# Altium project Embedded_board.PrjPCB
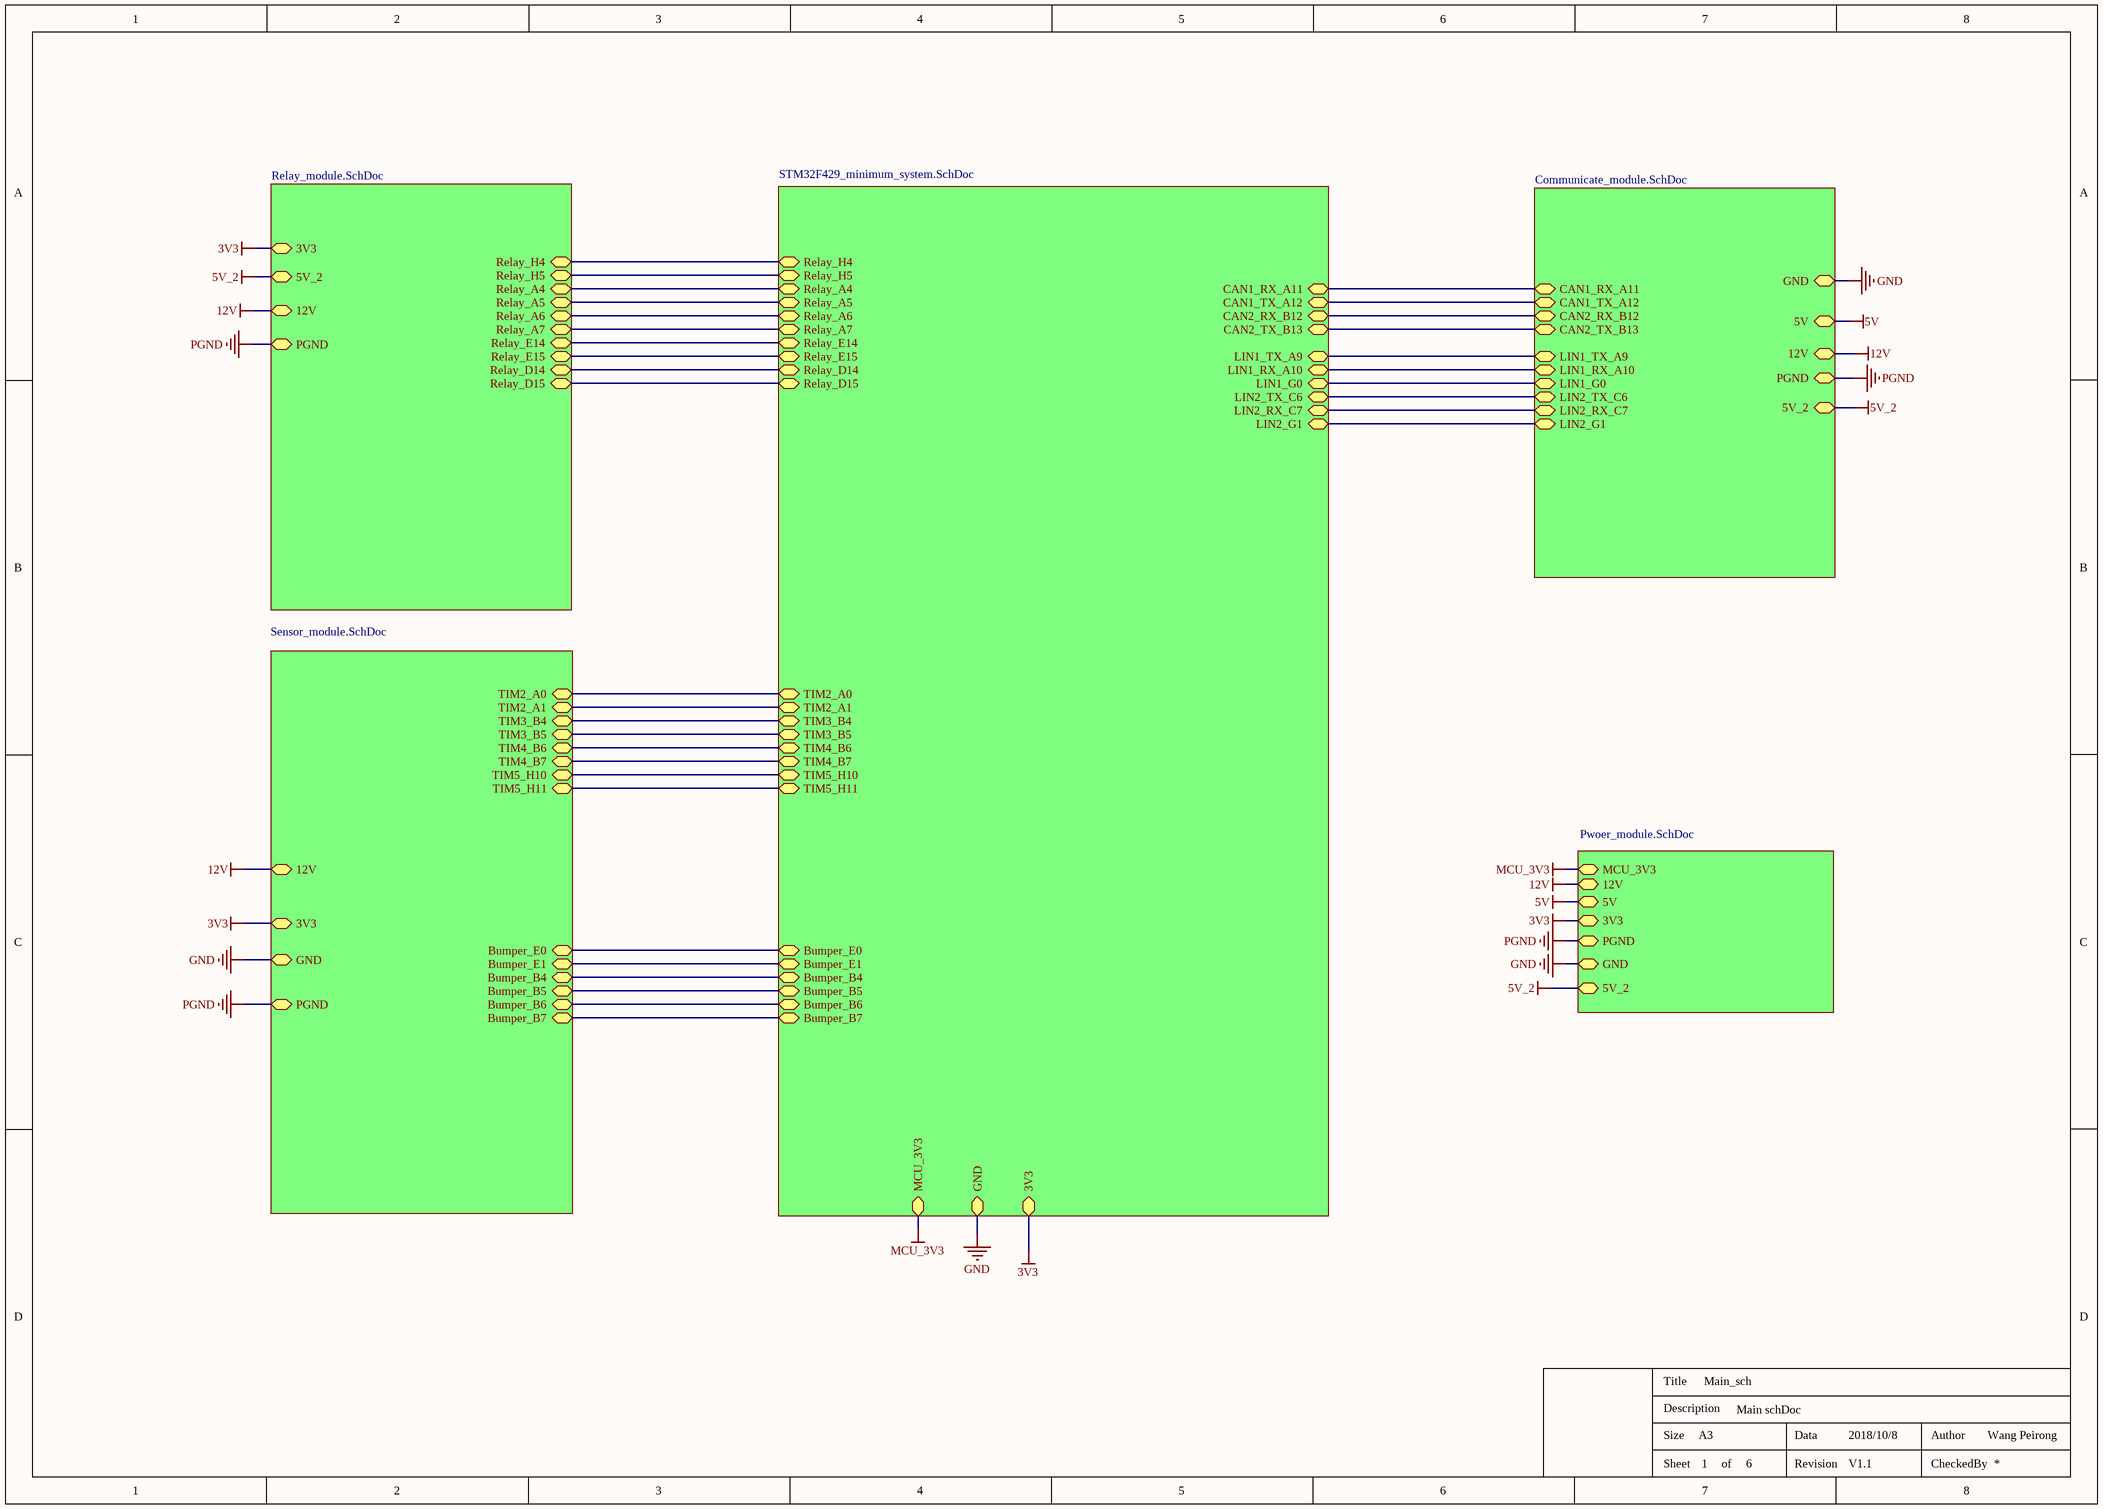
[diagram p0: Main_sch.SchDoc]
6 sheets, 264 parts. Net scope: hierarchical (ports join the sheet entries above them; power ports are global).
Board file: Embedded_board.PcbDoc
Sheets:
  Main_sch.SchDoc
     = Pwoer_module.SchDoc
     = Sensor_module.SchDoc
     = STM32F429_minimum_system.SchDoc
     = Relay_module.SchDoc
     = Communicate_module.SchDoc

## Sheet Main_sch.SchDoc: Main_sch
size A3; Date: 2018/10/8; Author: Wang Peirong; Revision: V1.1; SheetNumber: 1; SheetTotal: Main schDoc; Size: A3; Pages: 6

### Sub-sheets
? = Pwoer_module.SchDoc: 3V3, 12V, 5V, GND, PGND, 5V_2, MCU_3V3
? = Sensor_module.SchDoc: 12V, 3V3, GND, PGND, TIM2_A0, TIM2_A1, TIM3_B4, TIM3_B5, TIM4_B6, TIM4_B7, TIM5_H10, TIM5_H11, Bumper_E0, Bumper_E1, Bumper_B4, Bumper_B5, Bumper_B6, Bumper_B7
? = STM32F429_minimum_system.SchDoc: MCU_3V3, GND, CAN2_RX_B12, CAN2_TX_B13, CAN1_RX_A11, CAN1_TX_A12, TIM2_A0, TIM2_A1, TIM3_B4, TIM3_B5, TIM4_B6, TIM4_B7, TIM5_H10, TIM5_H11, Bumper_E0, Bumper_E1, Bumper_B4, Bumper_B5, Bumper_B6, Bumper_B7, Relay_H4, Relay_H5, Relay_A4, Relay_A5, Relay_A6, Relay_A7, Relay_E14, Relay_E15, LIN1_TX_A9, LIN1_RX_A10, LIN1_G0, LIN2_G1, LIN2_RX_C7, LIN2_TX_C6, Relay_D14, Relay_D15, 3V3
? = Relay_module.SchDoc: 3V3, 5V_2, 12V, PGND, Relay_H4, Relay_H5, Relay_A4, Relay_A5, Relay_A6, Relay_A7, Relay_E14, Relay_E15, Relay_D14, Relay_D15
? = Communicate_module.SchDoc: GND, 5V, CAN1_RX_A11, CAN1_TX_A12, CAN2_RX_B12, CAN2_TX_B13, 12V, PGND, LIN1_TX_A9, LIN1_RX_A10, 5V_2, LIN2_G1, LIN1_G0, LIN2_RX_C7, LIN2_TX_C6

### Nets
3V3: sheet /3V3, sheet /3V3, sheet /3V3, sheet /3V3
5V: sheet /5V, sheet /5V
5V_2: sheet /5V_2, sheet /5V_2, sheet /5V_2
12V: sheet /12V, sheet /12V, sheet /12V, sheet /12V
GND: sheet /GND, sheet /GND, sheet /GND, sheet /GND
MCU_3V3: sheet /MCU_3V3, sheet /MCU_3V3
PGND: sheet /PGND, sheet /PGND, sheet /PGND, sheet /PGND
H4: sheet /Relay_H4, sheet /Relay_H4
H5: sheet /Relay_H5, sheet /Relay_H5
NetJ1_4: sheet /TIM2_A0, sheet /TIM2_A0
NetJ2_4: sheet /TIM2_A1, sheet /TIM2_A1
NetJ3_4: sheet /TIM3_B4, sheet /TIM3_B4
NetJ4_4: sheet /TIM3_B5, sheet /TIM3_B5
NetJ5_4: sheet /TIM4_B6, sheet /TIM4_B6
NetJ6_4: sheet /TIM4_B7, sheet /TIM4_B7
NetJ7_4: sheet /TIM5_H10, sheet /TIM5_H10
NetJ8_4: sheet /TIM5_H11, sheet /TIM5_H11
NetJ9_4: sheet /Bumper_B5, sheet /Bumper_B5
NetJ10_4: sheet /Bumper_B6, sheet /Bumper_B6
NetJ11_4: sheet /Bumper_B7, sheet /Bumper_B7
NetJ12_4: sheet /Bumper_E0, sheet /Bumper_E0
NetJ13_4: sheet /Bumper_E1, sheet /Bumper_E1
NetJ14_4: sheet /Bumper_B4, sheet /Bumper_B4
NetJ23_2: sheet /LIN1_TX_A9, sheet /LIN1_TX_A9
NetJ24_4: sheet /LIN1_RX_A10, sheet /LIN1_RX_A10
NetJ25_2: sheet /LIN1_G0, sheet /LIN1_G0
NetJ26_4: sheet /LIN2_RX_C7, sheet /LIN2_RX_C7
NetJ27_2: sheet /LIN2_G1, sheet /LIN2_G1
NetJ28_2: sheet /LIN2_TX_C6, sheet /LIN2_TX_C6
NetR49_1: sheet /Relay_A4, sheet /Relay_A4
NetR53_1: sheet /Relay_A5, sheet /Relay_A5
NetR57_1: sheet /Relay_A6, sheet /Relay_A6
NetR61_1: sheet /Relay_A7, sheet /Relay_A7
NetR65_2: sheet /Relay_E14, sheet /Relay_E14
NetR69_1: sheet /Relay_E15, sheet /Relay_E15
NetR97_1: sheet /Relay_D14, sheet /Relay_D14
NetR101_2: sheet /Relay_D15, sheet /Relay_D15
NetU1_92: sheet /CAN2_RX_B12, sheet /CAN2_RX_B12
NetU1_93: sheet /CAN2_TX_B13, sheet /CAN2_TX_B13
NetU1_122: sheet /CAN1_RX_A11, sheet /CAN1_RX_A11
NetU1_123: sheet /CAN1_TX_A12, sheet /CAN1_TX_A12

### Notes on the sheet
- Title
- Description
- Size
- Data
- Author
- Sheet
- of
- Revision
- CheckedBy

## Sheet Pwoer_module.SchDoc: Power_module
size A4; Date: 2018/10/8; Author: Wang Peirong; Revision: V1.1; SheetNumber: 3; Descripton: Supply 12V ，5V，3.3V; pages: 6; Size: A4
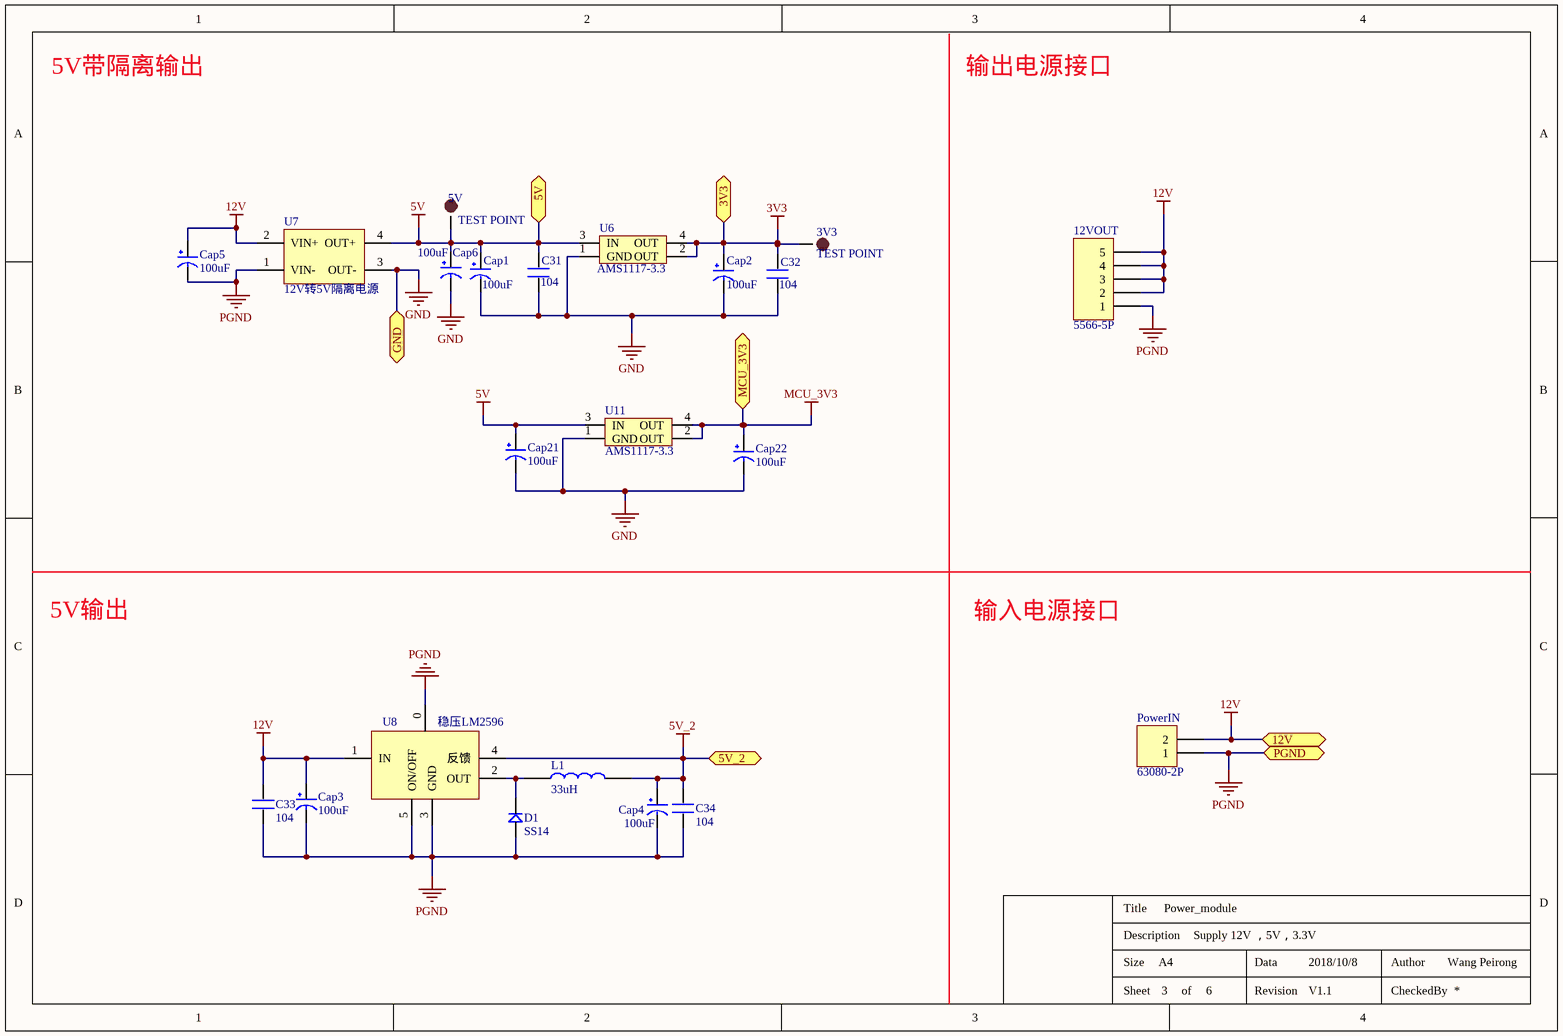
[diagram p1: Pwoer_module.SchDoc]

### Parts
3V3  TEST POINT  [TP-1.5]
5V  TEST POINT  [TP-1.5]
12VOUT  5566-5P  [5566-5P]
C31  104  [0603P]
C32  104  [0603P]
C33  104  [0603P]
C34  104  [0603P]
Cap1  100uF  [CC6.56.5]
Cap2  100uF  [CC6.56.5]
Cap3  100uF  [CC6.56.5]
Cap4  100uF  [CC6.56.5]
Cap5  100uF  [CC6.56.5]
Cap6  100uF  [CC6.56.5]
Cap21  100uF  [CC6.56.5]
Cap22  100uF  [CC6.56.5]
D1  SS14  [DIODE_SOP]
L1  value 33uH  [电感-10*10]  (hidden comment: 6电感)
PowerIN  63080-2P  [63038-2P]
U6  AMS1117-3.3  [AMS1117]
U7  12V转5V隔离电源  [WRB1205MH]
U8  稳压LM2596  [TO-263-5]
U11  AMS1117-3.3  [AMS1117]

### Ports
3V3, 5V, 5V_2, 12V, GND, MCU_3V3, PGND

### Nets
3V3: 3V3.1 C32.2 Cap2.1(VCC) U6.2(OUT) U6.4(OUT) ; port 3V3
5V: 5V.1 C31.2 Cap1.1(VCC) Cap6.1(VCC) Cap21.1(VCC) U6.3(IN) U7.4(OUT+) U11.3(IN) ; port 5V
5V_2: C34.2 Cap4.1(VCC) L1.2 U8.4(反馈) ; port 5V_2
12V: 12VOUT.2 12VOUT.3 12VOUT.4 12VOUT.5 C33.2 Cap3.1(VCC) Cap5.1(VCC) PowerIN.2 U7.2(VIN+) U8.1(IN) ; port 12V
GND: C31.1 C32.1 Cap1.2(GND) Cap2.2(GND) Cap6.2(GND) Cap21.2(GND) Cap22.2(GND) U6.1(GND) U7.3(OUT-) U11.1(GND) ; port GND
MCU_3V3: Cap22.1(VCC) U11.2(OUT) U11.4(OUT) ; port MCU_3V3
PGND: 12VOUT.1 C33.1 C34.1 Cap3.2(GND) Cap4.2(GND) Cap5.2(GND) D1.1 PowerIN.1 U7.1(VIN-) U8.0 U8.3(GND) U8.5(ON/OFF) ; port PGND
NetD1_2: D1.2 L1.1 U8.2(OUT)

### Notes on the sheet
- 5V带隔离输出
- 输出电源接口
- 5V输出
- 输入电源接口
- Title
- Description
- Size
- Data
- Author
- Sheet
- of
- Revision
- CheckedBy

### Library data of the parts
3V3 5V = TEST-POINT: 测试点
12VOUT = Header 5: Header, 5-Pin; LatestRevisionDate: 17-Jul-2002; LatestRevisionNote: Re-released for DXP Platform.; Publisher: Altium Limited
C31-C34 = C
Cap1-Cap6 Cap21 Cap22 = CAP
D1 = D
L1 = 6电感: Adjustable Inductor; Set Position: 0.5; Published: 24-Mar-1999; LatestRevisionDate: 17-Jul-2002; LatestRevisionNote: Re-released for DXP Platform.; PackageReference: AXIAL-0.8; Publisher: Altium Limited; PackageDescription: Axial Device, Thru-Hole; 2 Leads; 0.8 in Pin Spacing
PowerIN = Header 2: Header, 2-Pin; LatestRevisionDate: 17-Jul-2002; LatestRevisionNote: Re-released for DXP Platform.; Publisher: Altium Limited
U6 U11 = AMS1117

## Sheet Sensor_module.SchDoc: Sensor_module
size A4; Date: 2018/10/8; Author: Wang Peirong; Revision: V1.1; SheetNumber: 4; Descripton: Encoder interface and bumper interface; pages: 6; Size: A4
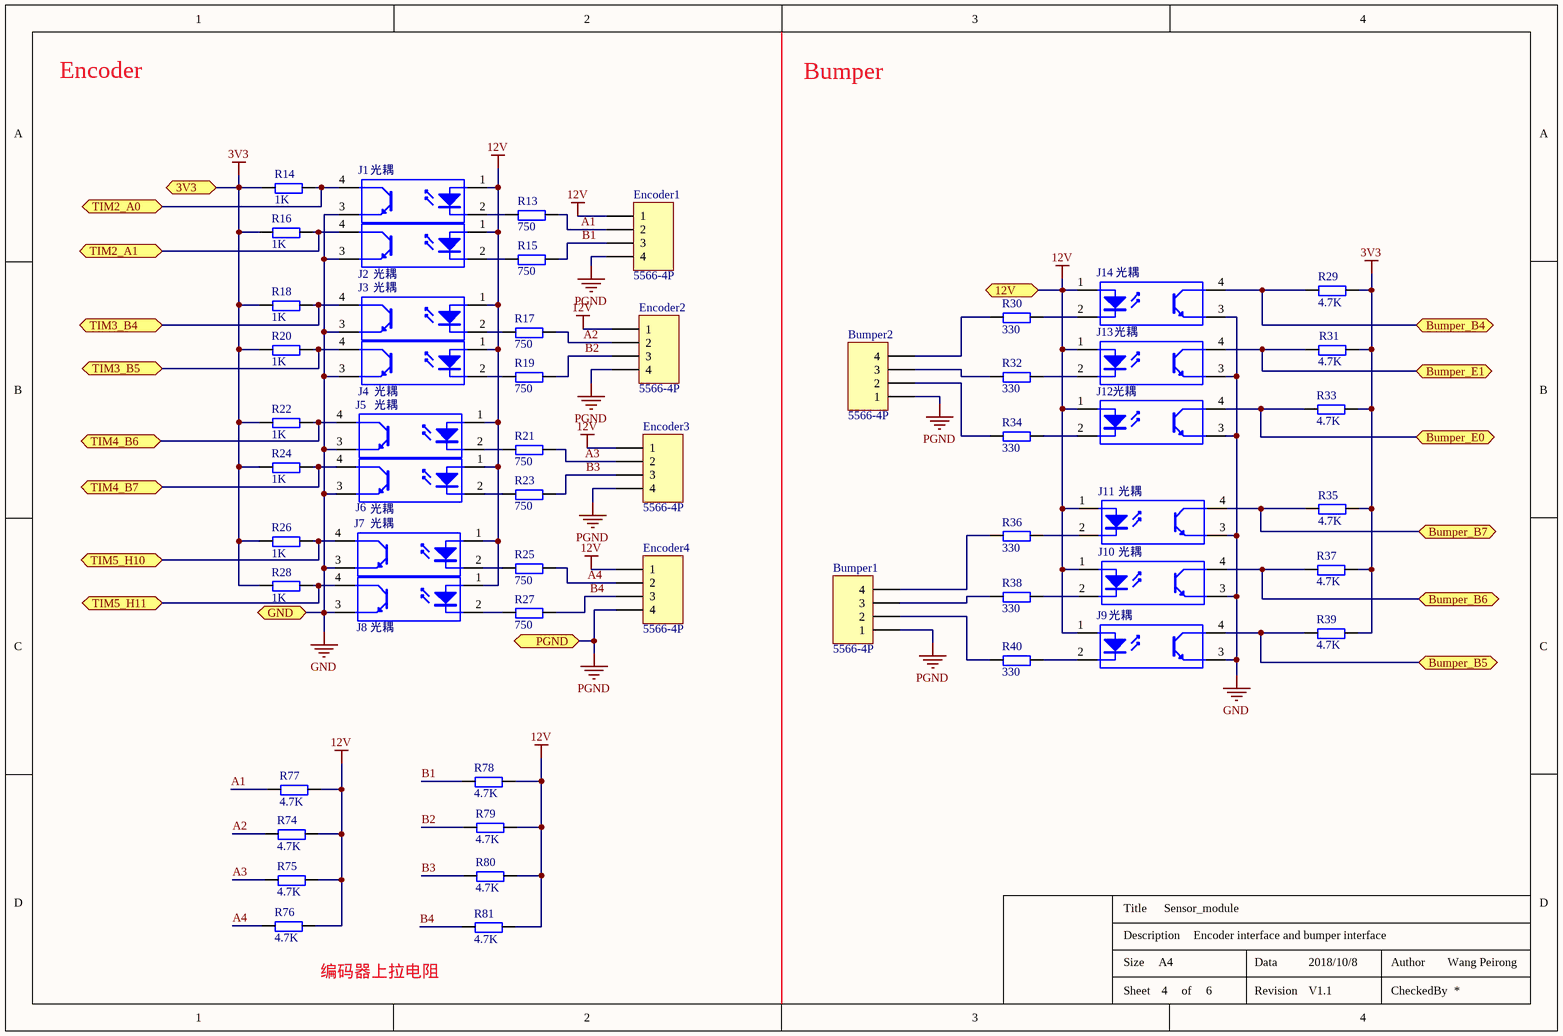
[diagram p2: Sensor_module.SchDoc]

### Parts
Bumper1  5566-4P  [5566-4P]
Bumper2  5566-4P  [5566-4P]
Encoder1  5566-4P  [5566-4P]
Encoder2  5566-4P  [5566-4P]
Encoder3  5566-4P  [5566-4P]
Encoder4  5566-4P  [5566-4P]
J1  光耦  [SOP127P710X350-4N]
J2  光耦  [SOP127P710X350-4N]
J3  光耦  [SOP127P710X350-4N]
J4  光耦  [SOP127P710X350-4N]
J5  光耦  [SOP127P710X350-4N]
J6  光耦  [SOP127P710X350-4N]
J7  光耦  [SOP127P710X350-4N]
J8  光耦  [SOP127P710X350-4N]
J9  光耦  [SOP127P710X350-4N]
J10  光耦  [SOP127P710X350-4N]
J11  光耦  [SOP127P710X350-4N]
J12  光耦  [SOP127P710X350-4N]
J13  光耦  [SOP127P710X350-4N]
J14  光耦  [SOP127P710X350-4N]
R13  750  [0603P]
R14  1K  [0603P]
R15  750  [0603P]
R16  1K  [0603P]
R17  750  [0603P]
R18  1K  [0603P]
R19  750  [0603P]
R20  1K  [0603P]
R21  750  [0603P]
R22  1K  [0603P]
R23  750  [0603P]
R24  1K  [0603P]
R25  750  [0603P]
R26  1K  [0603P]
R27  750  [0603P]
R28  1K  [0603P]
R29  4.7K  [0603P]
R30  330  [0603P]
R31  4.7K  [0603P]
R32  330  [0603P]
R33  4.7K  [0603P]
R34  330  [0603P]
R35  4.7K  [0603P]
R36  330  [0603P]
R37  4.7K  [0603P]
R38  330  [0603P]
R39  4.7K  [0603P]
R40  330  [0603P]
R74  4.7K  [0603P]
R75  4.7K  [0603P]
R76  4.7K  [0603P]
R77  4.7K  [0603P]
R78  4.7K  [0603P]
R79  4.7K  [0603P]
R80  4.7K  [0603P]
R81  4.7K  [0603P]

### Ports
3V3, 12V, Bumper_B4, Bumper_B5, Bumper_B6, Bumper_B7, Bumper_E0, Bumper_E1, GND, PGND, TIM2_A0, TIM2_A1, TIM3_B4, TIM3_B5, TIM4_B6, TIM4_B7, TIM5_H10, TIM5_H11

### Nets
3V3: R14.2 R16.2 R18.2 R20.2 R22.2 R24.2 R26.2 R28.2 R29.2 R31.2 R33.2 R35.2 R37.2 R39.2 ; port 3V3
12V: Encoder1.1 Encoder2.1 Encoder3.1 Encoder4.1 J1.1(A) J2.1(A) J3.1(A) J4.1(A) J5.1(A) J6.1(A) J7.1(A) J8.1(A) J9.1(A) J10.1(A) J11.1(A) J12.1(A) J13.1(A) J14.1(A) R74.2 R75.2 R76.2 R77.2 R78.2 R79.2 R80.2 R81.2 ; port 12V
GND: J1.3(E) J2.3(E) J3.3(E) J4.3(E) J5.3(E) J6.3(E) J7.3(E) J8.3(E) J9.3(E) J10.3(E) J11.3(E) J12.3(E) J13.3(E) J14.3(E) ; port GND
PGND: Bumper1.1 Bumper2.1 Encoder1.4 Encoder2.4 Encoder3.4 Encoder4.4 ; port PGND
A1: Encoder1.2 R13.1 R77.1
A2: Encoder2.2 R17.1 R74.1
A3: Encoder3.2 R21.1 R75.1
A4: Encoder4.2 R25.1 R76.1
B1: Encoder1.3 R15.1 R78.1
B2: Encoder2.3 R19.1 R79.1
B3: Encoder3.3 R23.1 R80.1
B4: Encoder4.3 R27.1 R81.1
NetBumper1_2: Bumper1.2 R40.1
NetBumper1_3: Bumper1.3 R38.1
NetBumper1_4: Bumper1.4 R36.1
NetBumper2_2: Bumper2.2 R34.1
NetBumper2_3: Bumper2.3 R32.1
NetBumper2_4: Bumper2.4 R30.1
NetJ1_2: J1.2(K) R13.2
NetJ1_4: J1.4(C) R14.1 ; port TIM2_A0
NetJ2_2: J2.2(K) R15.2
NetJ2_4: J2.4(C) R16.1 ; port TIM2_A1
NetJ3_2: J3.2(K) R17.2
NetJ3_4: J3.4(C) R18.1 ; port TIM3_B4
NetJ4_2: J4.2(K) R19.2
NetJ4_4: J4.4(C) R20.1 ; port TIM3_B5
NetJ5_2: J5.2(K) R21.2
NetJ5_4: J5.4(C) R22.1 ; port TIM4_B6
NetJ6_2: J6.2(K) R23.2
NetJ6_4: J6.4(C) R24.1 ; port TIM4_B7
NetJ7_2: J7.2(K) R25.2
NetJ7_4: J7.4(C) R26.1 ; port TIM5_H10
NetJ8_2: J8.2(K) R27.2
NetJ8_4: J8.4(C) R28.1 ; port TIM5_H11
NetJ9_2: J9.2(K) R40.2
NetJ9_4: J9.4(C) R39.1 ; port Bumper_B5
NetJ10_2: J10.2(K) R38.2
NetJ10_4: J10.4(C) R37.1 ; port Bumper_B6
NetJ11_2: J11.2(K) R36.2
NetJ11_4: J11.4(C) R35.1 ; port Bumper_B7
NetJ12_2: J12.2(K) R34.2
NetJ12_4: J12.4(C) R33.1 ; port Bumper_E0
NetJ13_2: J13.2(K) R32.2
NetJ13_4: J13.4(C) R31.1 ; port Bumper_E1
NetJ14_2: J14.2(K) R30.2
NetJ14_4: J14.4(C) R29.1 ; port Bumper_B4

### Notes on the sheet
- Encoder
- Bumper
- (near R76) 编码器上拉电阻
- Title
- Description
- Size
- Data
- Author
- Sheet
- of
- Revision
- CheckedBy

### Library data of the parts
Bumper1 Bumper2 Encoder1-Encoder4 = Header 4: Header, 4-Pin; LatestRevisionDate: 17-Jul-2002; LatestRevisionNote: Re-released for DXP Platform.; Publisher: Altium Limited
R13-R40 R74-R81 = R
J1-J14 = 光耦: Published: 24-Mar-1999; LatestRevisionDate: 04-Mar-2005; LatestRevisionNote: Sch pins 3 & 4 Swapped.; DatasheetDocument: Nov-2003; PackageReference: DIP-4; Publisher: Altium Limited

## Sheet STM32F429_minimum_system.SchDoc: STM32F429_minimum_system
size A3; Date: 2018/10/8; Author: WangPeirong; Revision: V1.1; SheetNumber: 2; SheetTotal: STM32F429IGT6 minimun system schdoc; Size: A3; Pages: 6
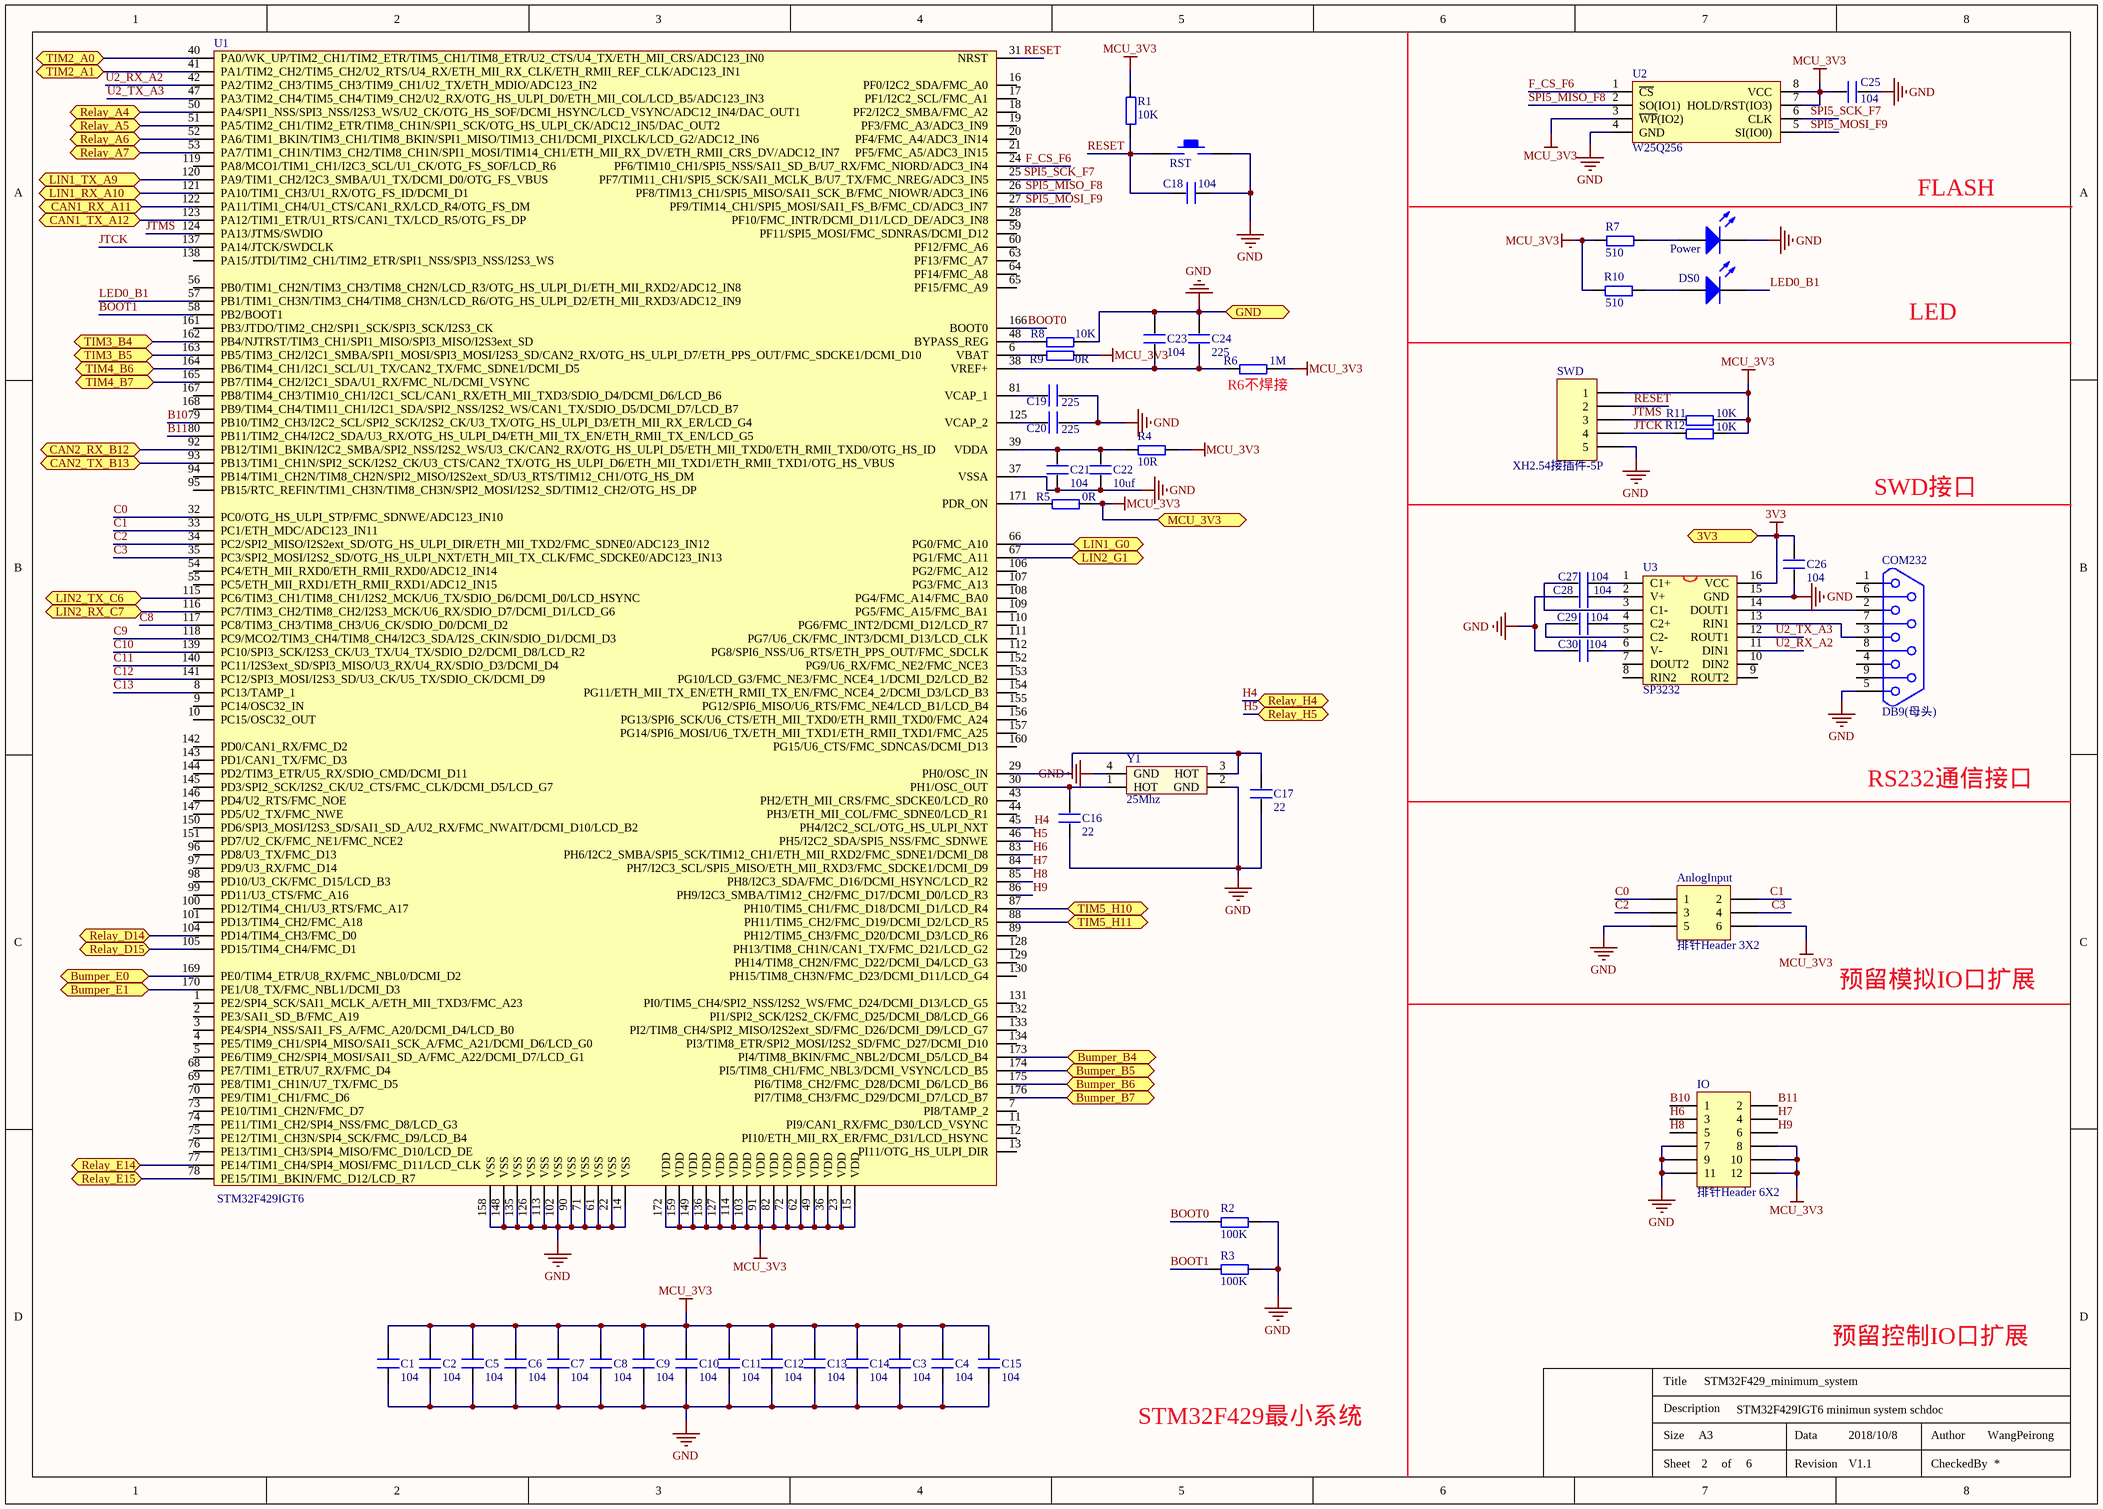
[diagram p3: STM32F429_minimum_system.SchDoc]

### Parts
AnlogInput  排针Header 3X2  [F-HEADER-2*3-2.54MM]
C1  104  [0603P]
C2  104  [0603P]
C3  104  [0603P]
C4  104  [0603P]
C5  104  [0603P]
C6  104  [0603P]
C7  104  [0603P]
C8  104  [0603P]
C9  104  [0603P]
C10  104  [0603P]
C11  104  [0603P]
C12  104  [0603P]
C13  104  [0603P]
C14  104  [0603P]
C15  104  [0603P]
C16  22  [0603P]
C17  22  [0603P]
C18  104  [0603P]
C19  225  [0603P]
C20  225  [0603P]
C21  104  [0603P]
C22  10uf  [0603P]
C23  104  [0603P]
C24  225  [0603P]
C25  104  [0603P]
C26  104  [0603P]
C27  104  [0603P]
C28  104  [0603P]
C29  104  [0603P]
C30  104  [0603P]
COM232  DB9(母头)  [DB9]
DS0  LED绿色  [SMDLED]  (value not drawn)
IO  排针Header 6X2  [F-HEADER-2*6-2.54MM]
Power  LED红色  [SMDLED]  (value not drawn)
R1  10K  [0603P]
R2  100K  [0603P]
R3  100K  [0603P]
R4  10R  [0603P]
R5  0R  [0603P]
R6  1M  [0603P]
R7  510  [0603P]
R8  10K  [0603P]
R9  0R  [0603P]
R10  510  [0603P]
R11  10K  [0603P]
R12  10K  [0603P]
RST  KEY_M  [KEY_SOP3625]  (value not drawn)
SWD  XH2.54接插件-5P  [F-HEADER-5-2.54MM]
U1  STM32F429IGT6  [LQFP176]
U2  W25Q256  [WSON8]
U3  SP3232  [SOP16M]
Y1  25Mhz  [XTAL3225]

### Ports
3V3, Bumper_B4, Bumper_B5, Bumper_B6, Bumper_B7, Bumper_E0, Bumper_E1, CAN1_RX_A11, CAN1_TX_A12, CAN2_RX_B12, CAN2_TX_B13, GND, LIN1_G0, LIN1_RX_A10, LIN1_TX_A9, LIN2_G1, LIN2_RX_C7, LIN2_TX_C6, MCU_3V3, Relay_A4, Relay_A5, Relay_A6, Relay_A7, Relay_D14, Relay_D15, Relay_E14, Relay_E15, Relay_H4, Relay_H5, TIM2_A0, TIM2_A1, TIM3_B4, TIM3_B5, TIM4_B6, TIM4_B7, TIM5_H10, TIM5_H11

### Nets
3V3: C26.2 U3.16(VCC) ; port 3V3
GND: AnlogInput.5 C1.1 C2.1 C3.1 C4.1 C5.1 C6.1 C7.1 C8.1 C9.1 C10.1 C11.1 C12.1 C13.1 C14.1 C15.1 C16.2 C17.2 C18.2 C19.2 C20.2 C21.1 C22.1 C23.2 C24.2 C25.2 C26.1 C28.2 C30.2 COM232.5 IO.7 IO.9 IO.11 Power.2(K) R2.2 R3.2 R8.2 RST.2 SWD.5 U1.14(VSS) U1.22(VSS) U1.37(VSSA) U1.61(VSS) U1.71(VSS) U1.90(VSS) U1.102(VSS) U1.113(VSS) U1.126(VSS) U1.135(VSS) U1.148(VSS) U1.158(VSS) U2.4(GND) U3.15(GND) Y1.2(GND) Y1.4(GND) ; port GND
MCU_3V3: AnlogInput.6 C1.2 C2.2 C3.2 C4.2 C5.2 C6.2 C7.2 C8.2 C9.2 C10.2 C11.2 C12.2 C13.2 C14.2 C15.2 C25.1 IO.8 IO.10 IO.12 R1.2 R4.2 R5.2 R6.2 R7.1 R9.2 R10.1 R11.2 R12.2 SWD.1 U1.15(VDD) U1.23(VDD) U1.36(VDD) U1.49(VDD) U1.62(VDD) U1.72(VDD) U1.82(VDD) U1.91(VDD) U1.103(VDD) U1.114(VDD) U1.127(VDD) U1.136(VDD) U1.149(VDD) U1.159(VDD) U1.172(VDD) U2.3(~{WP}(IO2)) U2.7(HOLD/RST(IO3)) U2.8(VCC) ; port MCU_3V3
B10: IO.1 U1.79(PB10/TIM2_CH3/I2C2_SCL/SPI2_SCK/I2S2_CK/U3_TX/OTG_HS_ULPI_D3/ETH_MII_RX_ER/LCD_G4)
B11: IO.2 U1.80(PB11/TIM2_CH4/I2C2_SDA/U3_RX/OTG_HS_ULPI_D4/ETH_MII_TX_EN/ETH_RMII_TX_EN/LCD_G5)
BOOT0: R2.1 U1.166(BOOT0)
BOOT1: R3.1 U1.58(PB2/BOOT1)
C0: AnlogInput.1 U1.32(PC0/OTG_HS_ULPI_STP/FMC_SDNWE/ADC123_IN10)
C1: AnlogInput.2 U1.33(PC1/ETH_MDC/ADC123_IN11)
C2: AnlogInput.3 U1.34(PC2/SPI2_MISO/I2S2ext_SD/OTG_HS_ULPI_DIR/ETH_MII_TXD2/FMC_SDNE0/ADC123_IN12)
C3: AnlogInput.4 U1.35(PC3/SPI2_MOSI/I2S2_SD/OTG_HS_ULPI_NXT/ETH_MII_TX_CLK/FMC_SDCKE0/ADC123_IN13)
C8: U1.117(PC8/TIM3_CH3/TIM8_CH3/U6_CK/SDIO_D0/DCMI_D2)
C9: U1.118(PC9/MCO2/TIM3_CH4/TIM8_CH4/I2C3_SDA/I2S_CKIN/SDIO_D1/DCMI_D3)
C10: U1.139(PC10/SPI3_SCK/I2S3_CK/U3_TX/U4_TX/SDIO_D2/DCMI_D8/LCD_R2)
C11: U1.140(PC11/I2S3ext_SD/SPI3_MISO/U3_RX/U4_RX/SDIO_D3/DCMI_D4)
C12: U1.141(PC12/SPI3_MOSI/I2S3_SD/U3_CK/U5_TX/SDIO_CK/DCMI_D9)
C13: U1.8(PC13/TAMP_1)
F_CS_F6: U1.24(PF6/TIM10_CH1/SPI5_NSS/SAI1_SD_B/U7_RX/FMC_NIORD/ADC3_IN4) U2.1(~{CS})
H4: U1.45(PH4/I2C2_SCL/OTG_HS_ULPI_NXT) ; port Relay_H4
H5: U1.46(PH5/I2C2_SDA/SPI5_NSS/FMC_SDNWE) ; port Relay_H5
H6: IO.3 U1.83(PH6/I2C2_SMBA/SPI5_SCK/TIM12_CH1/ETH_MII_RXD2/FMC_SDNE1/DCMI_D8)
H7: IO.4 U1.84(PH7/I2C3_SCL/SPI5_MISO/ETH_MII_RXD3/FMC_SDCKE1/DCMI_D9)
H8: IO.5 U1.85(PH8/I2C3_SDA/FMC_D16/DCMI_HSYNC/LCD_R2)
H9: IO.6 U1.86(PH9/I2C3_SMBA/TIM12_CH2/FMC_D17/DCMI_D0/LCD_R3)
JTCK: R12.1 SWD.4 U1.137(PA14/JTCK/SWDCLK)
JTMS: R11.1 SWD.3 U1.124(PA13/JTMS/SWDIO)
LED0_B1: DS0.2(K) U1.57(PB1/TIM1_CH3N/TIM3_CH4/TIM8_CH3N/LCD_R6/OTG_HS_ULPI_D2/ETH_MII_RXD3/ADC12_IN9)
RESET: C18.1 R1.1 RST.1 SWD.2 U1.31(NRST)
SPI5_MISO_F8: U1.26(PF8/TIM13_CH1/SPI5_MISO/SAI1_SCK_B/FMC_NIOWR/ADC3_IN6) U2.2(SO(IO1))
SPI5_MOSI_F9: U1.27(PF9/TIM14_CH1/SPI5_MOSI/SAI1_FS_B/FMC_CD/ADC3_IN7) U2.5(SI(IO0))
SPI5_SCK_F7: U1.25(PF7/TIM11_CH1/SPI5_SCK/SAI1_MCLK_B/U7_TX/FMC_NREG/ADC3_IN5) U2.6(CLK)
U2_RX_A2: U1.42(PA2/TIM2_CH3/TIM5_CH3/TIM9_CH1/U2_TX/ETH_MDIO/ADC123_IN2) U3.11(DIN1)
U2_TX_A3: U1.47(PA3/TIM2_CH4/TIM5_CH4/TIM9_CH2/U2_RX/OTG_HS_ULPI_D0/ETH_MII_COL/LCD_B5/ADC123_IN3) U3.12(ROUT1)
NetC16_1: C16.1 U1.30(PH1/OSC_OUT) Y1.1(HOT)
NetC17_1: C17.1 U1.29(PH0/OSC_IN) Y1.3(HOT)
NetC19_1: C19.1 U1.81(VCAP_1)
NetC20_1: C20.1 U1.125(VCAP_2)
NetC21_2: C21.2 C22.2 R4.1 U1.39(VDDA)
NetC23_1: C23.1 C24.1 R6.1 U1.38(VREF+)
NetC27_1: C27.1 U3.1(C1+)
NetC27_2: C27.2 U3.3(C1-)
NetC28_1: C28.1 U3.2(V+)
NetC29_1: C29.1 U3.4(C2+)
NetC29_2: C29.2 U3.5(C2-)
NetC30_1: C30.1 U3.6(V-)
NetCOM232_2: COM232.2 U3.14(DOUT1)
NetCOM232_3: COM232.3 U3.13(RIN1)
NetDS0_1: DS0.1(A) R10.2
NetJ1_4: U1.40(PA0/WK_UP/TIM2_CH1/TIM2_ETR/TIM5_CH1/TIM8_ETR/U2_CTS/U4_TX/ETH_MII_CRS/ADC123_IN0) ; port TIM2_A0
NetJ2_4: U1.41(PA1/TIM2_CH2/TIM5_CH2/U2_RTS/U4_RX/ETH_MII_RX_CLK/ETH_RMII_REF_CLK/ADC123_IN1) ; port TIM2_A1
NetJ3_4: U1.162(PB4/NJTRST/TIM3_CH1/SPI1_MISO/SPI3_MISO/I2S3ext_SD) ; port TIM3_B4
NetJ4_4: U1.163(PB5/TIM3_CH2/I2C1_SMBA/SPI1_MOSI/SPI3_MOSI/I2S3_SD/CAN2_RX/OTG_HS_ULPI_D7/ETH_PPS_OUT/FMC_SDCKE1/DCMI_D10) ; port TIM3_B5
NetJ5_4: U1.164(PB6/TIM4_CH1/I2C1_SCL/U1_TX/CAN2_TX/FMC_SDNE1/DCMI_D5) ; port TIM4_B6
NetJ6_4: U1.165(PB7/TIM4_CH2/I2C1_SDA/U1_RX/FMC_NL/DCMI_VSYNC) ; port TIM4_B7
NetJ7_4: U1.87(PH10/TIM5_CH1/FMC_D18/DCMI_D1/LCD_R4) ; port TIM5_H10
NetJ8_4: U1.88(PH11/TIM5_CH2/FMC_D19/DCMI_D2/LCD_R5) ; port TIM5_H11
NetJ9_4: U1.174(PI5/TIM8_CH1/FMC_NBL3/DCMI_VSYNC/LCD_B5) ; port Bumper_B5
NetJ10_4: U1.175(PI6/TIM8_CH2/FMC_D28/DCMI_D6/LCD_B6) ; port Bumper_B6
NetJ11_4: U1.176(PI7/TIM8_CH3/FMC_D29/DCMI_D7/LCD_B7) ; port Bumper_B7
NetJ12_4: U1.169(PE0/TIM4_ETR/U8_RX/FMC_NBL0/DCMI_D2) ; port Bumper_E0
NetJ13_4: U1.170(PE1/U8_TX/FMC_NBL1/DCMI_D3) ; port Bumper_E1
NetJ14_4: U1.173(PI4/TIM8_BKIN/FMC_NBL2/DCMI_D5/LCD_B4) ; port Bumper_B4
NetJ23_2: U1.120(PA9/TIM1_CH2/I2C3_SMBA/U1_TX/DCMI_D0/OTG_FS_VBUS) ; port LIN1_TX_A9
NetJ24_4: U1.121(PA10/TIM1_CH3/U1_RX/OTG_FS_ID/DCMI_D1) ; port LIN1_RX_A10
NetJ25_2: U1.66(PG0/FMC_A10) ; port LIN1_G0
NetJ26_4: U1.116(PC7/TIM3_CH2/TIM8_CH2/I2S3_MCK/U6_RX/SDIO_D7/DCMI_D1/LCD_G6) ; port LIN2_RX_C7
NetJ27_2: U1.67(PG1/FMC_A11) ; port LIN2_G1
NetJ28_2: U1.115(PC6/TIM3_CH1/TIM8_CH1/I2S2_MCK/U6_TX/SDIO_D6/DCMI_D0/LCD_HSYNC) ; port LIN2_TX_C6
NetPower_1: Power.1(A) R7.2
NetR5_1: R5.1 U1.171(PDR_ON)
NetR8_1: R8.1 U1.48(BYPASS_REG)
NetR9_1: R9.1 U1.6(VBAT)
NetR49_1: U1.50(PA4/SPI1_NSS/SPI3_NSS/I2S3_WS/U2_CK/OTG_HS_SOF/DCMI_HSYNC/LCD_VSYNC/ADC12_IN4/DAC_OUT1) ; port Relay_A4
NetR53_1: U1.51(PA5/TIM2_CH1/TIM2_ETR/TIM8_CH1N/SPI1_SCK/OTG_HS_ULPI_CK/ADC12_IN5/DAC_OUT2) ; port Relay_A5
NetR57_1: U1.52(PA6/TIM1_BKIN/TIM3_CH1/TIM8_BKIN/SPI1_MISO/TIM13_CH1/DCMI_PIXCLK/LCD_G2/ADC12_IN6) ; port Relay_A6
NetR61_1: U1.53(PA7/TIM1_CH1N/TIM3_CH2/TIM8_CH1N/SPI1_MOSI/TIM14_CH1/ETH_MII_RX_DV/ETH_RMII_CRS_DV/ADC12_IN7) ; port Relay_A7
NetR65_2: U1.77(PE14/TIM1_CH4/SPI4_MOSI/FMC_D11/LCD_CLK) ; port Relay_E14
NetR69_1: U1.78(PE15/TIM1_BKIN/FMC_D12/LCD_R7) ; port Relay_E15
NetR97_1: U1.104(PD14/TIM4_CH3/FMC_D0) ; port Relay_D14
NetR101_2: U1.105(PD15/TIM4_CH4/FMC_D1) ; port Relay_D15
NetU1_92: U1.92(PB12/TIM1_BKIN/I2C2_SMBA/SPI2_NSS/I2S2_WS/U3_CK/CAN2_RX/OTG_HS_ULPI_D5/ETH_MII_TXD0/ETH_RMII_TXD0/OTG_HS_ID) ; port CAN2_RX_B12
NetU1_93: U1.93(PB13/TIM1_CH1N/SPI2_SCK/I2S2_CK/U3_CTS/CAN2_TX/OTG_HS_ULPI_D6/ETH_MII_TXD1/ETH_RMII_TXD1/OTG_HS_VBUS) ; port CAN2_TX_B13
NetU1_122: U1.122(PA11/TIM1_CH4/U1_CTS/CAN1_RX/LCD_R4/OTG_FS_DM) ; port CAN1_RX_A11
NetU1_123: U1.123(PA12/TIM1_ETR/U1_RTS/CAN1_TX/LCD_R5/OTG_FS_DP) ; port CAN1_TX_A12

Not connected (* = marked no-connect by the designer): COM232 1 4 6 7 8 9; U1 1(PE2/SPI4_SCK/SAI1_MCLK_A/ETH_MII_TXD3/FMC_A23) 2(PE3/SAI1_SD_B/FMC_A19) 3(PE4/SPI4_NSS/SAI1_FS_A/FMC_A20/DCMI_D4/LCD_B0) 4(PE5/TIM9_CH1/SPI4_MISO/SAI1_SCK_A/FMC_A21/DCMI_D6/LCD_G0) 5(PE6/TIM9_CH2/SPI4_MOSI/SAI1_SD_A/FMC_A22/DCMI_D7/LCD_G1) 7(PI8/TAMP_2) 9(PC14/OSC32_IN) 10(PC15/OSC32_OUT) 11(PI9/CAN1_RX/FMC_D30/LCD_VSYNC) 12(PI10/ETH_MII_RX_ER/FMC_D31/LCD_HSYNC) 13(PI11/OTG_HS_ULPI_DIR) 16(PF0/I2C2_SDA/FMC_A0) 17(PF1/I2C2_SCL/FMC_A1) 18(PF2/I2C2_SMBA/FMC_A2) 19(PF3/FMC_A3/ADC3_IN9) 20(PF4/FMC_A4/ADC3_IN14) 21(PF5/FMC_A5/ADC3_IN15) 28(PF10/FMC_INTR/DCMI_D11/LCD_DE/ADC3_IN8) 43(PH2/ETH_MII_CRS/FMC_SDCKE0/LCD_R0) 44(PH3/ETH_MII_COL/FMC_SDNE0/LCD_R1) 54(PC4/ETH_MII_RXD0/ETH_RMII_RXD0/ADC12_IN14) 55(PC5/ETH_MII_RXD1/ETH_RMII_RXD1/ADC12_IN15) 56(PB0/TIM1_CH2N/TIM3_CH3/TIM8_CH2N/LCD_R3/OTG_HS_ULPI_D1/ETH_MII_RXD2/ADC12_IN8) 59(PF11/SPI5_MOSI/FMC_SDNRAS/DCMI_D12) 60(PF12/FMC_A6) 63(PF13/FMC_A7) 64(PF14/FMC_A8) 65(PF15/FMC_A9) 68(PE7/TIM1_ETR/U7_RX/FMC_D4) 69(PE8/TIM1_CH1N/U7_TX/FMC_D5) 70(PE9/TIM1_CH1/FMC_D6) 73(PE10/TIM1_CH2N/FMC_D7) 74(PE11/TIM1_CH2/SPI4_NSS/FMC_D8/LCD_G3) 75(PE12/TIM1_CH3N/SPI4_SCK/FMC_D9/LCD_B4) 76(PE13/TIM1_CH3/SPI4_MISO/FMC_D10/LCD_DE) 89(PH12/TIM5_CH3/FMC_D20/DCMI_D3/LCD_R6) 94(PB14/TIM1_CH2N/TIM8_CH2N/SPI2_MISO/I2S2ext_SD/U3_RTS/TIM12_CH1/OTG_HS_DM) 95(PB15/RTC_REFIN/TIM1_CH3N/TIM8_CH3N/SPI2_MOSI/I2S2_SD/TIM12_CH2/OTG_HS_DP) 96(PD8/U3_TX/FMC_D13) 97(PD9/U3_RX/FMC_D14) 98(PD10/U3_CK/FMC_D15/LCD_B3) 99(PD11/U3_CTS/FMC_A16) 100(PD12/TIM4_CH1/U3_RTS/FMC_A17) 101(PD13/TIM4_CH2/FMC_A18) 106(PG2/FMC_A12) 107(PG3/FMC_A13) 108(PG4/FMC_A14/FMC_BA0) 109(PG5/FMC_A15/FMC_BA1) 110(PG6/FMC_INT2/DCMI_D12/LCD_R7) 111(PG7/U6_CK/FMC_INT3/DCMI_D13/LCD_CLK) 112(PG8/SPI6_NSS/U6_RTS/ETH_PPS_OUT/FMC_SDCLK) 119(PA8/MCO1/TIM1_CH1/I2C3_SCL/U1_CK/OTG_FS_SOF/LCD_R6) 128(PH13/TIM8_CH1N/CAN1_TX/FMC_D21/LCD_G2) 129(PH14/TIM8_CH2N/FMC_D22/DCMI_D4/LCD_G3) 130(PH15/TIM8_CH3N/FMC_D23/DCMI_D11/LCD_G4) 131(PI0/TIM5_CH4/SPI2_NSS/I2S2_WS/FMC_D24/DCMI_D13/LCD_G5) 132(PI1/SPI2_SCK/I2S2_CK/FMC_D25/DCMI_D8/LCD_G6) 133(PI2/TIM8_CH4/SPI2_MISO/I2S2ext_SD/FMC_D26/DCMI_D9/LCD_G7) 134(PI3/TIM8_ETR/SPI2_MOSI/I2S2_SD/FMC_D27/DCMI_D10) 138(PA15/JTDI/TIM2_CH1/TIM2_ETR/SPI1_NSS/SPI3_NSS/I2S3_WS) 142(PD0/CAN1_RX/FMC_D2) 143(PD1/CAN1_TX/FMC_D3) 144(PD2/TIM3_ETR/U5_RX/SDIO_CMD/DCMI_D11) 145(PD3/SPI2_SCK/I2S2_CK/U2_CTS/FMC_CLK/DCMI_D5/LCD_G7) 146(PD4/U2_RTS/FMC_NOE) 147(PD5/U2_TX/FMC_NWE) 150(PD6/SPI3_MOSI/I2S3_SD/SAI1_SD_A/U2_RX/FMC_NWAIT/DCMI_D10/LCD_B2) 151(PD7/U2_CK/FMC_NE1/FMC_NCE2) 152(PG9/U6_RX/FMC_NE2/FMC_NCE3) 153(PG10/LCD_G3/FMC_NE3/FMC_NCE4_1/DCMI_D2/LCD_B2) 154(PG11/ETH_MII_TX_EN/ETH_RMII_TX_EN/FMC_NCE4_2/DCMI_D3/LCD_B3) 155(PG12/SPI6_MISO/U6_RTS/FMC_NE4/LCD_B1/LCD_B4) 156(PG13/SPI6_SCK/U6_CTS/ETH_MII_TXD0/ETH_RMII_TXD0/FMC_A24) 157(PG14/SPI6_MOSI/U6_TX/ETH_MII_TXD1/ETH_RMII_TXD1/FMC_A25) 160(PG15/U6_CTS/FMC_SDNCAS/DCMI_D13) 161(PB3/JTDO/TIM2_CH2/SPI1_SCK/SPI3_SCK/I2S3_CK) 167(PB8/TIM4_CH3/TIM10_CH1/I2C1_SCL/CAN1_RX/ETH_MII_TXD3/SDIO_D4/DCMI_D6/LCD_B6) 168(PB9/TIM4_CH4/TIM11_CH1/I2C1_SDA/SPI2_NSS/I2S2_WS/CAN1_TX/SDIO_D5/DCMI_D7/LCD_B7); U3 7(DOUT2) 8(RIN2) 9(ROUT2) 10(DIN2)

### Notes on the sheet
- FLASH
- LED
- (near R6) R6不焊接
- SWD接口
- RS232通信接口
- 预留模拟IO口扩展
- 预留控制IO口扩展
- STM32F429最小系统
- Title
- Description
- Size
- Data
- Author
- Sheet
- of
- Revision
- CheckedBy

### Library data of the parts
AnlogInput = Header 3X2: Header, 3-Pin, Dual row; LatestRevisionDate: 17-Jul-2002; LatestRevisionNote: Re-released for DXP Platform.; Publisher: Altium Limited
C1-C30 = C
COM232 = DB9
DS0 Power = LED2: Typical RED, GREEN, YELLOW, AMBER GaAs LED; Published: 8-Jun-2000; LatestRevisionDate: 17-Jul-2002; LatestRevisionNote: Re-released for DXP Platform.; PackageDocument: Feb-2002; PackageReference: 3.2X1.6X1.1; Publisher: Altium Limited
IO = Header 6X2: Header, 6-Pin, Dual row; LatestRevisionDate: 17-Jul-2002; LatestRevisionNote: Re-released for DXP Platform.; Publisher: Altium Limited
R1-R12 = R
SWD = Header 5: Header, 5-Pin; LatestRevisionDate: 17-Jul-2002; LatestRevisionNote: Re-released for DXP Platform.; Publisher: Altium Limited
U2 = W25Q128
U3 = MAX3232
Y1 = XTAL_3225: 3225贴片无源晶振

## Sheet Relay_module.SchDoc: Relays_module
size A3; Date: 2018/10/8; Author: Wang Peirong; Revision: V1.1; SheetNumber: 5; SheetTotal: Light relays and horn relay; Size: A3; Pages: 6
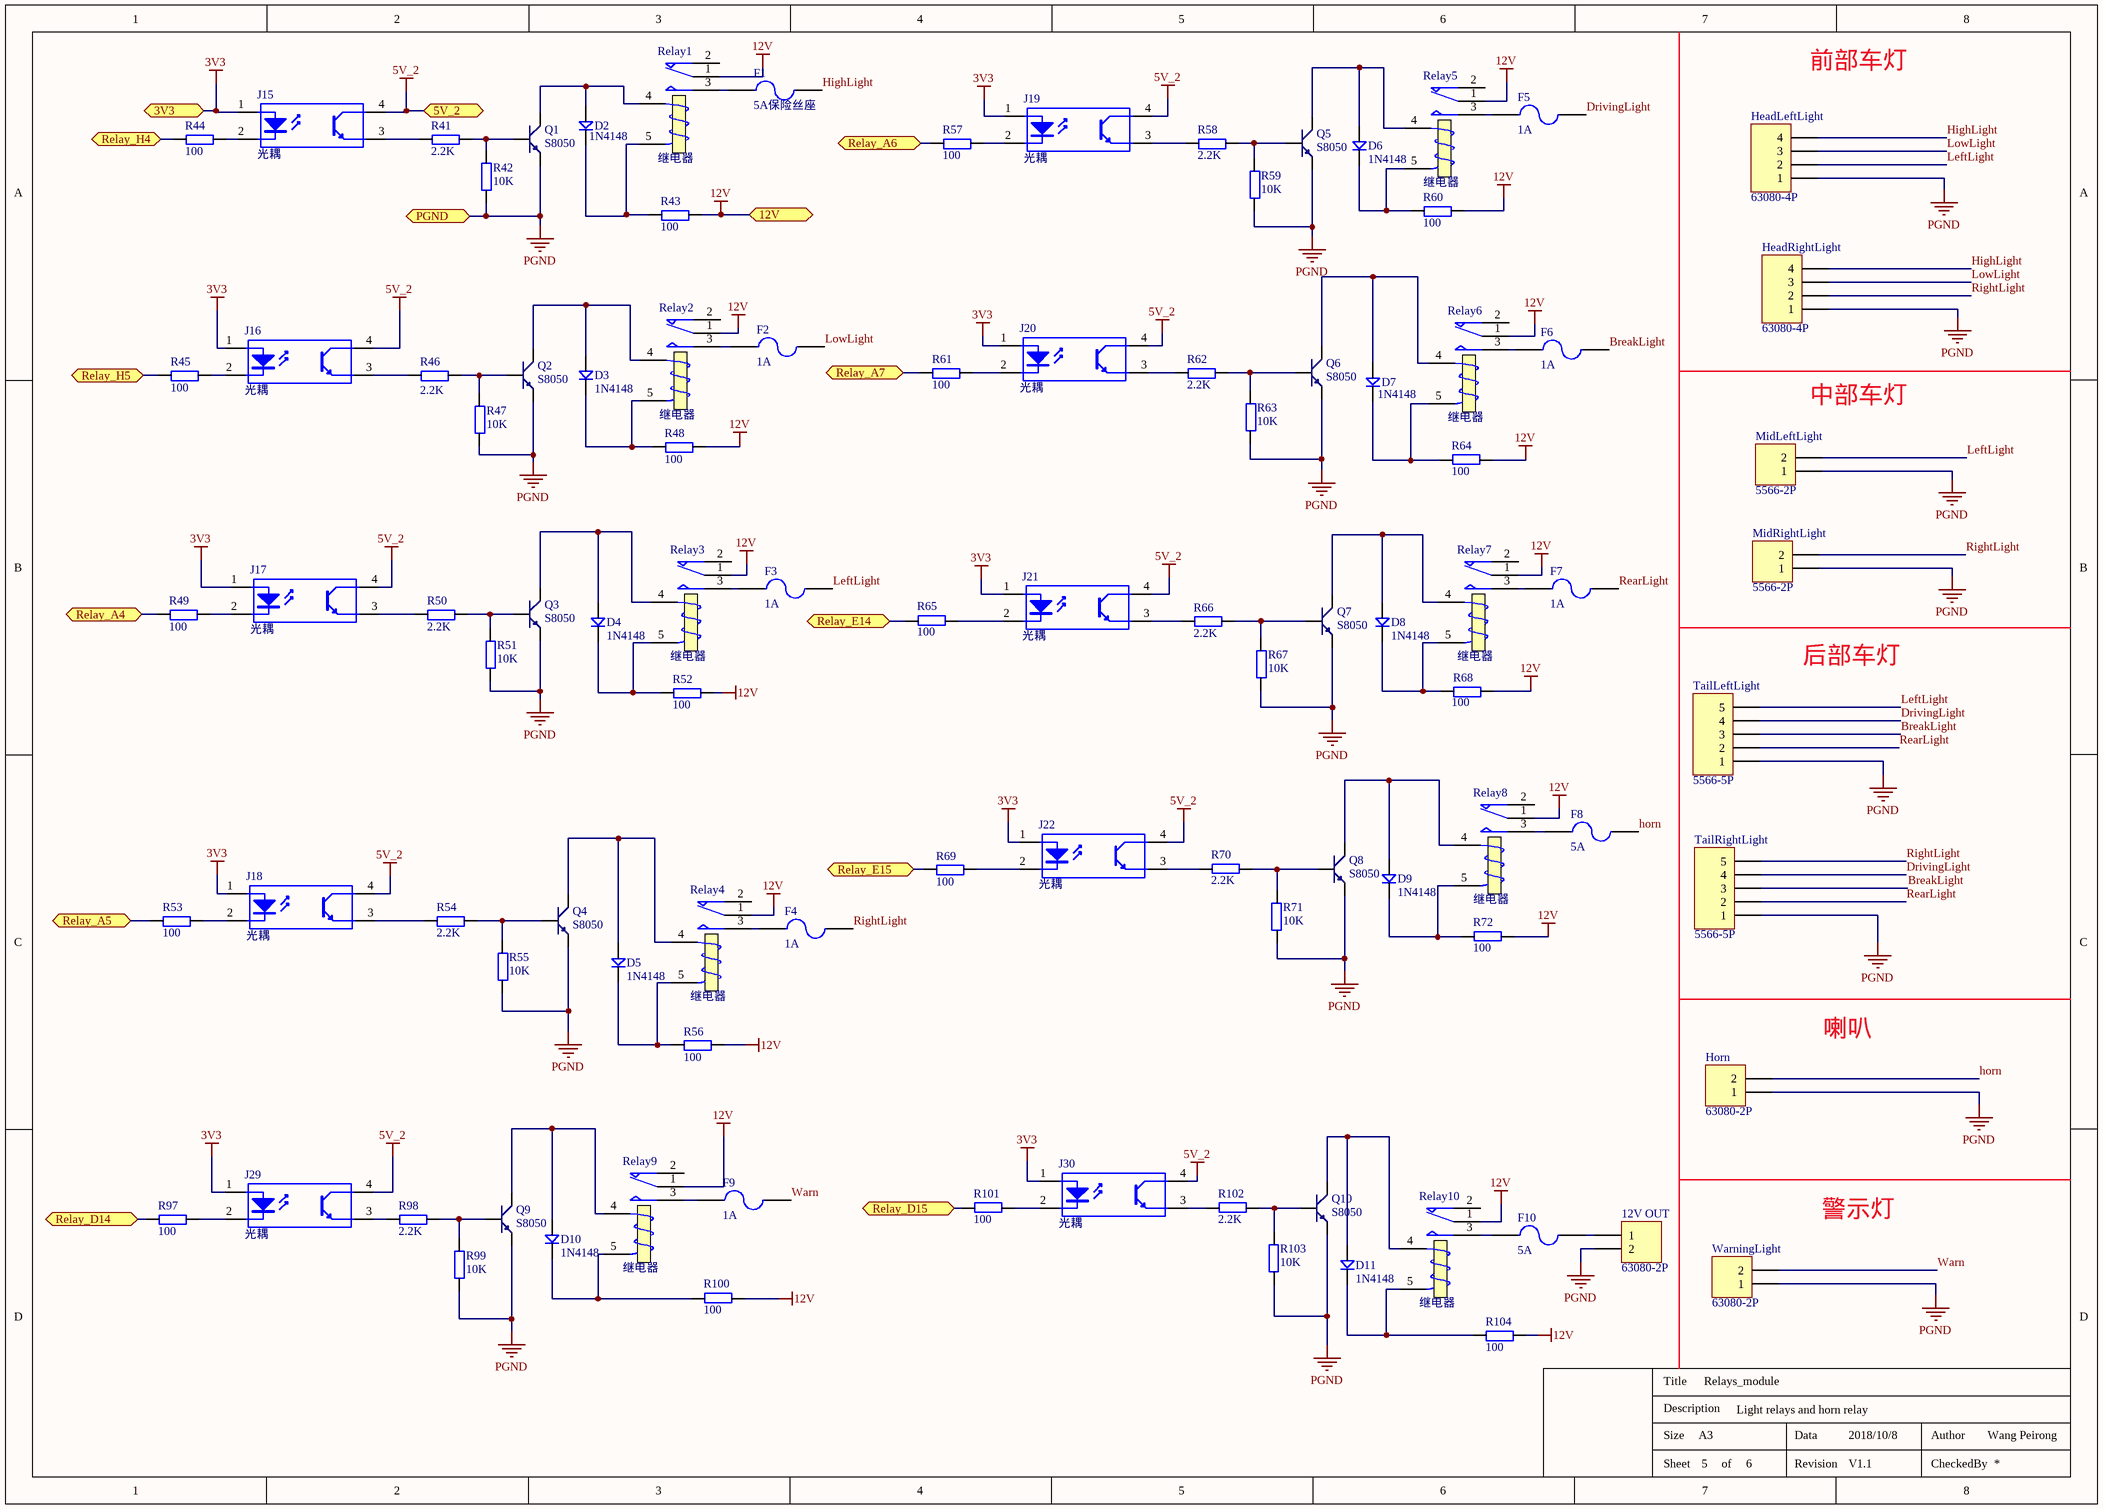
[diagram p4: Relay_module.SchDoc]

### Parts
12V_OUT  63080-2P  [63038-2P]
D2  1N4148  [DIODE_SOP]
D3  1N4148  [DIODE_SOP]
D4  1N4148  [DIODE_SOP]
D5  1N4148  [DIODE_SOP]
D6  1N4148  [DIODE_SOP]
D7  1N4148  [DIODE_SOP]
D8  1N4148  [DIODE_SOP]
D9  1N4148  [DIODE_SOP]
D10  1N4148  [DIODE_SOP]
D11  1N4148  [DIODE_SOP]
F1  value 5A保险丝座  [汽车保险丝座子]  (hidden comment: 5A)
F2  value 1A  [汽车保险丝座子]  (hidden comment: 5A保险丝座)
F3  value 1A  [汽车保险丝座子]  (hidden comment: 5A保险丝座)
F4  value 1A  [汽车保险丝座子]  (hidden comment: 5A保险丝座)
F5  value 1A  [汽车保险丝座子]  (hidden comment: 5A保险丝座)
F6  value 1A  [汽车保险丝座子]  (hidden comment: 5A保险丝座)
F7  value 1A  [汽车保险丝座子]  (hidden comment: 5A保险丝座)
F8  value 5A  [汽车保险丝座子]  (hidden comment: 5A保险丝座)
F9  value 1A  [汽车保险丝座子]  (hidden comment: 5A保险丝座)
F10  value 5A  [汽车保险丝座子]  (hidden comment: 5A保险丝座)
HeadLeftLight  63080-4P  [63080-4P]
HeadRightLight  63080-4P  [63080-4P]
Horn  63080-2P  [63038-2P]
J15  光耦  [SOP127P710X350-4N]
J16  光耦  [SOP127P710X350-4N]
J17  光耦  [SOP127P710X350-4N]
J18  光耦  [SOP127P710X350-4N]
J19  光耦  [SOP127P710X350-4N]
J20  光耦  [SOP127P710X350-4N]
J21  光耦  [SOP127P710X350-4N]
J22  光耦  [SOP127P710X350-4N]
J29  光耦  [SOP127P710X350-4N]
J30  光耦  [SOP127P710X350-4N]
MidLeftLight  5566-2P  [5566-2P]
MidRightLight  5566-2P  [5566-2P]
Q1  S8050  [SOT-23R]
Q2  S8050  [SOT-23R]
Q3  S8050  [SOT-23R]
Q4  S8050  [SOT-23R]
Q5  S8050  [SOT-23R]
Q6  S8050  [SOT-23R]
Q7  S8050  [SOT-23R]
Q8  S8050  [SOT-23R]
Q9  S8050  [SOT-23R]
Q10  S8050  [SOT-23R]
R41  2.2K  [0603P]
R42  10K  [0603P]
R43  100  [0603P]
R44  100  [0603P]
R45  100  [0603P]
R46  2.2K  [0603P]
R47  10K  [0603P]
R48  100  [0603P]
R49  100  [0603P]
R50  2.2K  [0603P]
R51  10K  [0603P]
R52  100  [0603P]
R53  100  [0603P]
R54  2.2K  [0603P]
R55  10K  [0603P]
R56  100  [0603P]
R57  100  [0603P]
R58  2.2K  [0603P]
R59  10K  [0603P]
R60  100  [0603P]
R61  100  [0603P]
R62  2.2K  [0603P]
R63  10K  [0603P]
R64  100  [0603P]
R65  100  [0603P]
R66  2.2K  [0603P]
R67  10K  [0603P]
R68  100  [0603P]
R69  100  [0603P]
R70  2.2K  [0603P]
R71  10K  [0603P]
R72  100  [0603P]
R97  100  [0603P]
R98  2.2K  [0603P]
R99  10K  [0603P]
R100  100  [0603P]
R101  100  [0603P]
R102  2.2K  [0603P]
R103  10K  [0603P]
R104  100  [0603P]
Relay1  继电器  [SRD-12VDC]
Relay2  继电器  [SRD-12VDC]
Relay3  继电器  [SRD-12VDC]
Relay4  继电器  [SRD-12VDC]
Relay5  继电器  [SRD-12VDC]
Relay6  继电器  [SRD-12VDC]
Relay7  继电器  [SRD-12VDC]
Relay8  继电器  [SRD-12VDC]
Relay9  继电器  [SRD-12VDC]
Relay10  继电器  [SRD-12VDC]
TailLeftLight  5566-5P  [5566-5P]
TailRightLight  5566-5P  [5566-5P]
WarningLight  63080-2P  [63038-2P]

### Ports
3V3, 5V_2, 12V, PGND, Relay_A4, Relay_A5, Relay_A6, Relay_A7, Relay_D14, Relay_D15, Relay_E14, Relay_E15, Relay_H4, Relay_H5

### Nets
3V3: J15.1(A) J16.1(A) J17.1(A) J18.1(A) J19.1(A) J20.1(A) J21.1(A) J22.1(A) J29.1(A) J30.1(A) ; port 3V3
5V_2: J15.4(C) J16.4(C) J17.4(C) J18.4(C) J19.4(C) J20.4(C) J21.4(C) J22.4(C) J29.4(C) J30.4(C) ; port 5V_2
12V: R43.2 R48.2 R52.2 R56.2 R60.2 R64.1 R68.2 R72.1 R100.1 R104.2 Relay1.1(COM) Relay2.1(COM) Relay3.1(COM) Relay4.1(COM) Relay5.1(COM) Relay6.1(COM) Relay7.1(COM) Relay8.1(COM) Relay9.1(COM) Relay10.1(COM) ; port 12V
PGND: 12V_OUT.2 HeadLeftLight.1 HeadRightLight.1 Horn.1 MidLeftLight.1 MidRightLight.1 Q1.1(E) Q2.1(E) Q3.1(E) Q4.1(E) Q5.1(E) Q6.1(E) Q7.1(E) Q8.1(E) Q9.1(E) Q10.1(E) R42.1 R47.1 R51.1 R55.1 R59.1 R63.1 R67.1 R71.2 R99.1 R103.2 TailLeftLight.1 TailRightLight.1 WarningLight.1 ; port PGND
BreakLight: F6.2 TailLeftLight.3 TailRightLight.3
DrivingLight: F5.2 TailLeftLight.4 TailRightLight.4
H4: R44.1 ; port Relay_H4
H5: R45.1 ; port Relay_H5
HighLight: F1.2 HeadLeftLight.4 HeadRightLight.4
horn: F8.2 Horn.2
LeftLight: F3.2 HeadLeftLight.2 MidLeftLight.2 TailLeftLight.5
LowLight: F2.2 HeadLeftLight.3 HeadRightLight.3
RearLight: F7.2 TailLeftLight.2 TailRightLight.2
RightLight: F4.2 HeadRightLight.2 MidRightLight.2 TailRightLight.5
Warn: F9.2 WarningLight.2
Net12V_OUT_1: 12V_OUT.1 F10.2
NetD2_1: D2.1 Q1.3(C) Relay1.4(T1)
NetD2_2: D2.2 R43.1 Relay1.5(T2)
NetD3_1: D3.1 Q2.3(C) Relay2.4(T1)
NetD3_2: D3.2 R48.1 Relay2.5(T2)
NetD4_1: D4.1 Q3.3(C) Relay3.4(T1)
NetD4_2: D4.2 R52.1 Relay3.5(T2)
NetD5_1: D5.1 Q4.3(C) Relay4.4(T1)
NetD5_2: D5.2 R56.1 Relay4.5(T2)
NetD6_1: D6.1 Q5.3(C) Relay5.4(T1)
NetD6_2: D6.2 R60.1 Relay5.5(T2)
NetD7_1: D7.1 Q6.3(C) Relay6.4(T1)
NetD7_2: D7.2 R64.2 Relay6.5(T2)
NetD8_1: D8.1 Q7.3(C) Relay7.4(T1)
NetD8_2: D8.2 R68.1 Relay7.5(T2)
NetD9_1: D9.1 Q8.3(C) Relay8.4(T1)
NetD9_2: D9.2 R72.2 Relay8.5(T2)
NetD10_1: D10.1 Q9.3(C) Relay9.4(T1)
NetD10_2: D10.2 R100.2 Relay9.5(T2)
NetD11_1: D11.1 Q10.3(C) Relay10.4(T1)
NetD11_2: D11.2 R104.1 Relay10.5(T2)
NetF1_1: F1.1 Relay1.3(NO)
NetF2_1: F2.1 Relay2.3(NO)
NetF3_1: F3.1 Relay3.3(NO)
NetF4_1: F4.1 Relay4.3(NO)
NetF5_1: F5.1 Relay5.3(NO)
NetF6_1: F6.1 Relay6.3(NO)
NetF7_1: F7.1 Relay7.3(NO)
NetF8_1: F8.1 Relay8.3(NO)
NetF9_1: F9.1 Relay9.3(NO)
NetF10_1: F10.1 Relay10.3(NO)
NetJ15_2: J15.2(K) R44.2
NetJ15_3: J15.3(E) R41.1
NetJ16_2: J16.2(K) R45.2
NetJ16_3: J16.3(E) R46.1
NetJ17_2: J17.2(K) R49.2
NetJ17_3: J17.3(E) R50.1
NetJ18_2: J18.2(K) R53.2
NetJ18_3: J18.3(E) R54.1
NetJ19_2: J19.2(K) R57.2
NetJ19_3: J19.3(E) R58.1
NetJ20_2: J20.2(K) R61.2
NetJ20_3: J20.3(E) R62.1
NetJ21_2: J21.2(K) R65.1
NetJ21_3: J21.3(E) R66.1
NetJ22_2: J22.2(K) R69.2
NetJ22_3: J22.3(E) R70.2
NetJ29_2: J29.2(K) R97.2
NetJ29_3: J29.3(E) R98.1
NetJ30_2: J30.2(K) R101.1
NetJ30_3: J30.3(E) R102.2
NetQ1_2: Q1.2(B) R41.2 R42.2
NetQ2_2: Q2.2(B) R46.2 R47.2
NetQ3_2: Q3.2(B) R50.2 R51.2
NetQ4_2: Q4.2(B) R54.2 R55.2
NetQ5_2: Q5.2(B) R58.2 R59.2
NetQ6_2: Q6.2(B) R62.2 R63.2
NetQ7_2: Q7.2(B) R66.2 R67.2
NetQ8_2: Q8.2(B) R70.1 R71.1
NetQ9_2: Q9.2(B) R98.2 R99.2
NetQ10_2: Q10.2(B) R102.1 R103.1
NetR49_1: R49.1 ; port Relay_A4
NetR53_1: R53.1 ; port Relay_A5
NetR57_1: R57.1 ; port Relay_A6
NetR61_1: R61.1 ; port Relay_A7
NetR65_2: R65.2 ; port Relay_E14
NetR69_1: R69.1 ; port Relay_E15
NetR97_1: R97.1 ; port Relay_D14
NetR101_2: R101.2 ; port Relay_D15

Not connected (* = marked no-connect by the designer): Relay1 2(NC); Relay2 2(NC); Relay3 2(NC); Relay4 2(NC); Relay5 2(NC); Relay6 2(NC); Relay7 2(NC); Relay8 2(NC); Relay9 2(NC); Relay10 2(NC)

### Notes on the sheet
- 前部车灯
- 中部车灯
- 后部车灯
- 喇叭
- 警示灯
- Title
- Description
- Size
- Data
- Author
- Sheet
- of
- Revision
- CheckedBy

### Library data of the parts
12V_OUT Horn MidLeftLight MidRightLight WarningLight = Header 2: Header, 2-Pin; LatestRevisionDate: 17-Jul-2002; LatestRevisionNote: Re-released for DXP Platform.; Publisher: Altium Limited
D2-D11 = D
F1-F10 = 保险丝: Published: 8-Jun-2000; LatestRevisionDate: 17-Jul-2002; LatestRevisionNote: Re-released for DXP Platform.; PackageReference: PIN-W2/E2.8; Publisher: Altium Limited
HeadLeftLight HeadRightLight = Header 4: Header, 4-Pin; LatestRevisionDate: 17-Jul-2002; LatestRevisionNote: Re-released for DXP Platform.; Publisher: Altium Limited
Q1-Q10 = NPN: 8050/BCW846/BCW847
R41-R72 R97-R104 = R
TailLeftLight TailRightLight = Header 5: Header, 5-Pin; LatestRevisionDate: 17-Jul-2002; LatestRevisionNote: Re-released for DXP Platform.; Publisher: Altium Limited
J15-J22 J29 J30 = 光耦: Published: 24-Mar-1999; LatestRevisionDate: 04-Mar-2005; LatestRevisionNote: Sch pins 3 & 4 Swapped.; DatasheetDocument: Nov-2003; PackageReference: DIP-4; Publisher: Altium Limited

## Sheet Communicate_module.SchDoc: communicate_module
size A4; Date: 2018/10/8; Author: Wang Peirong; Revision: V1.1; SheetNumber: 6; Descripton: Can and Lin; pages: 6; Size: A4
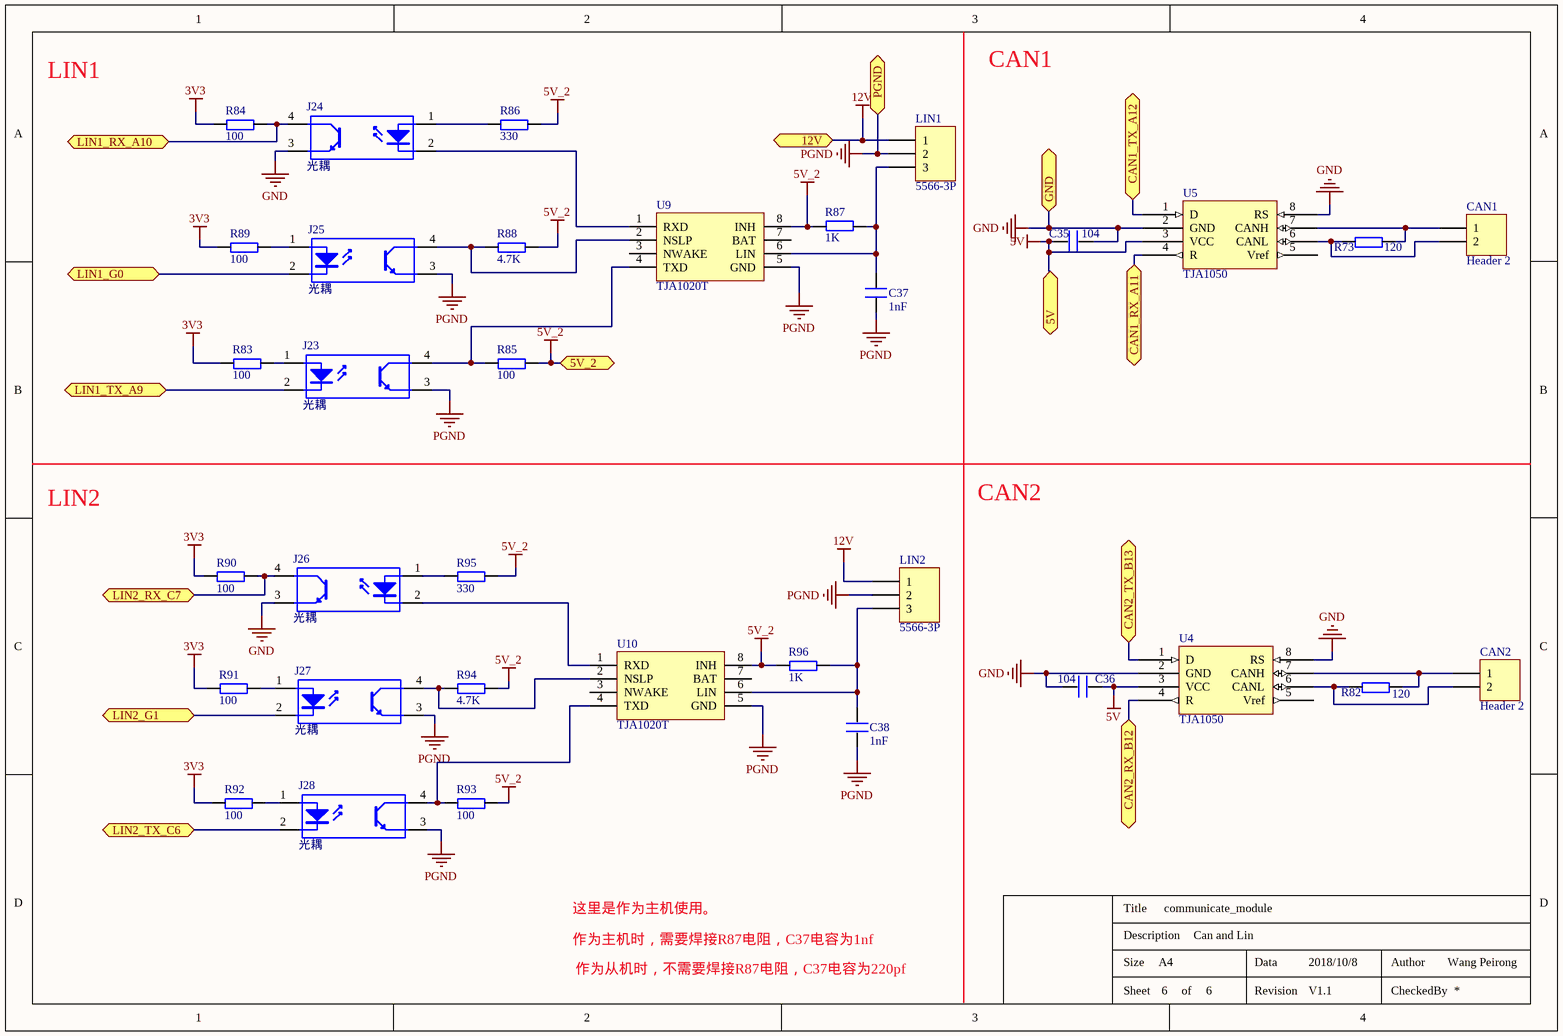
[diagram p5: Communicate_module.SchDoc]

### Parts
C35  104  [0603P]
C36  104  [0603P]
C37  1nF  [0603P]
C38  1nF  [0603P]
CAN1  Header 2  [5566-2P]
CAN2  Header 2  [5566-2P]
J23  光耦  [SOP127P710X350-4N]
J24  光耦  [SOP127P710X350-4N]
J25  光耦  [SOP127P710X350-4N]
J26  光耦  [SOP127P710X350-4N]
J27  光耦  [SOP127P710X350-4N]
J28  光耦  [SOP127P710X350-4N]
LIN1  5566-3P  [5566-3P]
LIN2  5566-3P  [5566-3P]
R73  120  [0603P]
R82  120  [0603P]
R83  100  [0603P]
R84  100  [0603P]
R85  100  [0603P]
R86  330  [0603P]
R87  1K  [0603P]
R88  4.7K  [0603P]
R89  100  [0603P]
R90  100  [0603P]
R91  100  [0603P]
R92  100  [0603P]
R93  100  [0603P]
R94  4.7K  [0603P]
R95  330  [0603P]
R96  1K  [0603P]
U4  TJA1050  [SOP-8]
U5  TJA1050  [SOP-8]
U9  TJA1020T  [NSO8_N]
U10  TJA1020T  [NSO8_N]

### Ports
5V, 5V_2, 12V, CAN1_RX_A11, CAN1_TX_A12, CAN2_RX_B12, CAN2_TX_B13, GND, LIN1_G0, LIN1_RX_A10, LIN1_TX_A9, LIN2_G1, LIN2_RX_C7, LIN2_TX_C6, PGND

### Nets
3V3: R83.1 R84.1 R89.1 R90.1 R91.1 R92.1
5V: C35.1 C36.2 U4.3(VCC) U5.3(VCC) ; port 5V
5V_2: R85.2 R86.2 R87.2 R88.2 R93.2 R94.2 R95.2 R96.1 U9.8(INH) U10.8(INH) ; port 5V_2
12V: LIN1.1 LIN2.1 ; port 12V
GND: C35.2 C36.1 J24.3(E) J26.3(E) U4.2(GND) U4.8(RS) U5.2(GND) U5.8(RS) ; port GND
PGND: C37.1 C38.1 J23.3(E) J25.3(E) J27.3(E) J28.3(E) LIN1.2 LIN2.2 U9.5(GND) U10.5(GND) ; port PGND
NetC37_2: C37.2 LIN1.3 R87.1 U9.6(LIN)
NetC38_2: C38.2 LIN2.3 R96.2 U10.6(LIN)
NetCAN1_1: CAN1.1 R73.2 U5.7(CANH)
NetCAN1_2: CAN1.2 R73.1 U5.6(CANL)
NetCAN2_1: CAN2.1 R82.2 U4.7(CANH)
NetCAN2_2: CAN2.2 R82.1 U4.6(CANL)
NetJ23_1: J23.1(A) R83.2
NetJ23_2: J23.2(K) ; port LIN1_TX_A9
NetJ23_4: J23.4(C) R85.1 U9.4(TXD)
NetJ24_1: J24.1(A) R86.1
NetJ24_2: J24.2(K) U9.1(RXD)
NetJ24_4: J24.4(C) R84.2 ; port LIN1_RX_A10
NetJ25_1: J25.1(A) R89.2
NetJ25_2: J25.2(K) ; port LIN1_G0
NetJ25_4: J25.4(C) R88.1 U9.2(NSLP)
NetJ26_1: J26.1(A) R95.1
NetJ26_2: J26.2(K) U10.1(RXD)
NetJ26_4: J26.4(C) R90.2 ; port LIN2_RX_C7
NetJ27_1: J27.1(A) R91.2
NetJ27_2: J27.2(K) ; port LIN2_G1
NetJ27_4: J27.4(C) R94.1 U10.2(NSLP)
NetJ28_1: J28.1(A) R92.2
NetJ28_2: J28.2(K) ; port LIN2_TX_C6
NetJ28_4: J28.4(C) R93.1 U10.4(TXD)
NetU1_92: U4.4(R) ; port CAN2_RX_B12
NetU1_93: U4.1(D) ; port CAN2_TX_B13
NetU1_122: U5.4(R) ; port CAN1_RX_A11
NetU1_123: U5.1(D) ; port CAN1_TX_A12

Not connected (* = marked no-connect by the designer): U4 5(Vref); U5 5(Vref); U9 3(NWAKE) 7(BAT); U10 3(NWAKE) 7(BAT)

### Notes on the sheet
- LIN1
- CAN1
- LIN2
- CAN2
- 这里是作为主机使用。
- 作为主机时，需要焊接R87电阻，C37电容为1nf
- 作为从机时，不需要焊接R87电阻，C37电容为220pf
- Title
- Description
- Size
- Data
- Author
- Sheet
- of
- Revision
- CheckedBy

### Library data of the parts
C35-C38 = C
CAN1 CAN2 = Header 2: Header, 2-Pin; LatestRevisionDate: 17-Jul-2002; LatestRevisionNote: Re-released for DXP Platform.; Publisher: Altium Limited
LIN1 LIN2 = Header 3: Header, 3-Pin; LatestRevisionDate: 17-Jul-2002; LatestRevisionNote: Re-released for DXP Platform.; Publisher: Altium Limited
R73 R82-R96 = R
U4 U5 = SN65HVD230D
J23-J28 = 光耦: Published: 24-Mar-1999; LatestRevisionDate: 04-Mar-2005; LatestRevisionNote: Sch pins 3 & 4 Swapped.; DatasheetDocument: Nov-2003; PackageReference: DIP-4; Publisher: Altium Limited

## Nets that join several sheets
3V3: Pwoer_module (5 pins), Sensor_module (14 pins), STM32F429_minimum_system (C26.2 U3.16), Relay_module (10 pins), Communicate_module (6 pins)
5V: Pwoer_module (8 pins), Communicate_module (C35.1 C36.2 U4.3 U5.3)
5V_2: Pwoer_module (C34.2 Cap4.1 L1.2 U8.4), Relay_module (10 pins), Communicate_module (10 pins)
12V: Pwoer_module (10 pins), Sensor_module (26 pins), Relay_module (20 pins), Communicate_module (LIN1.1 LIN2.1)
GND: Pwoer_module (10 pins), Sensor_module (14 pins), STM32F429_minimum_system (55 pins), Communicate_module (8 pins)
MCU_3V3: Pwoer_module (Cap22.1 U11.2 U11.4), STM32F429_minimum_system (48 pins)
PGND: Pwoer_module (12 pins), Sensor_module (6 pins), Relay_module (29 pins), Communicate_module (10 pins)
H4: STM32F429_minimum_system (U1.45), Relay_module (R44.1)
H5: STM32F429_minimum_system (U1.46), Relay_module (R45.1)
NetJ1_4: Sensor_module (J1.4 R14.1), STM32F429_minimum_system (U1.40)
NetJ2_4: Sensor_module (J2.4 R16.1), STM32F429_minimum_system (U1.41)
NetJ3_4: Sensor_module (J3.4 R18.1), STM32F429_minimum_system (U1.162)
NetJ4_4: Sensor_module (J4.4 R20.1), STM32F429_minimum_system (U1.163)
NetJ5_4: Sensor_module (J5.4 R22.1), STM32F429_minimum_system (U1.164)
NetJ6_4: Sensor_module (J6.4 R24.1), STM32F429_minimum_system (U1.165)
NetJ7_4: Sensor_module (J7.4 R26.1), STM32F429_minimum_system (U1.87)
NetJ8_4: Sensor_module (J8.4 R28.1), STM32F429_minimum_system (U1.88)
NetJ9_4: Sensor_module (J9.4 R39.1), STM32F429_minimum_system (U1.174)
NetJ10_4: Sensor_module (J10.4 R37.1), STM32F429_minimum_system (U1.175)
NetJ11_4: Sensor_module (J11.4 R35.1), STM32F429_minimum_system (U1.176)
NetJ12_4: Sensor_module (J12.4 R33.1), STM32F429_minimum_system (U1.169)
NetJ13_4: Sensor_module (J13.4 R31.1), STM32F429_minimum_system (U1.170)
NetJ14_4: Sensor_module (J14.4 R29.1), STM32F429_minimum_system (U1.173)
NetJ23_2: STM32F429_minimum_system (U1.120), Communicate_module (J23.2)
NetJ24_4: STM32F429_minimum_system (U1.121), Communicate_module (J24.4 R84.2)
NetJ25_2: STM32F429_minimum_system (U1.66), Communicate_module (J25.2)
NetJ26_4: STM32F429_minimum_system (U1.116), Communicate_module (J26.4 R90.2)
NetJ27_2: STM32F429_minimum_system (U1.67), Communicate_module (J27.2)
NetJ28_2: STM32F429_minimum_system (U1.115), Communicate_module (J28.2)
NetR49_1: STM32F429_minimum_system (U1.50), Relay_module (R49.1)
NetR53_1: STM32F429_minimum_system (U1.51), Relay_module (R53.1)
NetR57_1: STM32F429_minimum_system (U1.52), Relay_module (R57.1)
NetR61_1: STM32F429_minimum_system (U1.53), Relay_module (R61.1)
NetR65_2: STM32F429_minimum_system (U1.77), Relay_module (R65.2)
NetR69_1: STM32F429_minimum_system (U1.78), Relay_module (R69.1)
NetR97_1: STM32F429_minimum_system (U1.104), Relay_module (R97.1)
NetR101_2: STM32F429_minimum_system (U1.105), Relay_module (R101.2)
NetU1_92: STM32F429_minimum_system (U1.92), Communicate_module (U4.4)
NetU1_93: STM32F429_minimum_system (U1.93), Communicate_module (U4.1)
NetU1_122: STM32F429_minimum_system (U1.122), Communicate_module (U5.4)
NetU1_123: STM32F429_minimum_system (U1.123), Communicate_module (U5.1)